# Altium project 724452_RPL-HX_Mobile_AEP_Rev0p91.PrjPcb (part 3 of 13)

### Notes on the sheet
- (in symbol C_RPL_HX_EXT, part A) 1 OF 19

## Sheet 0015_Processor - MEMORY.SchDoc
size A3
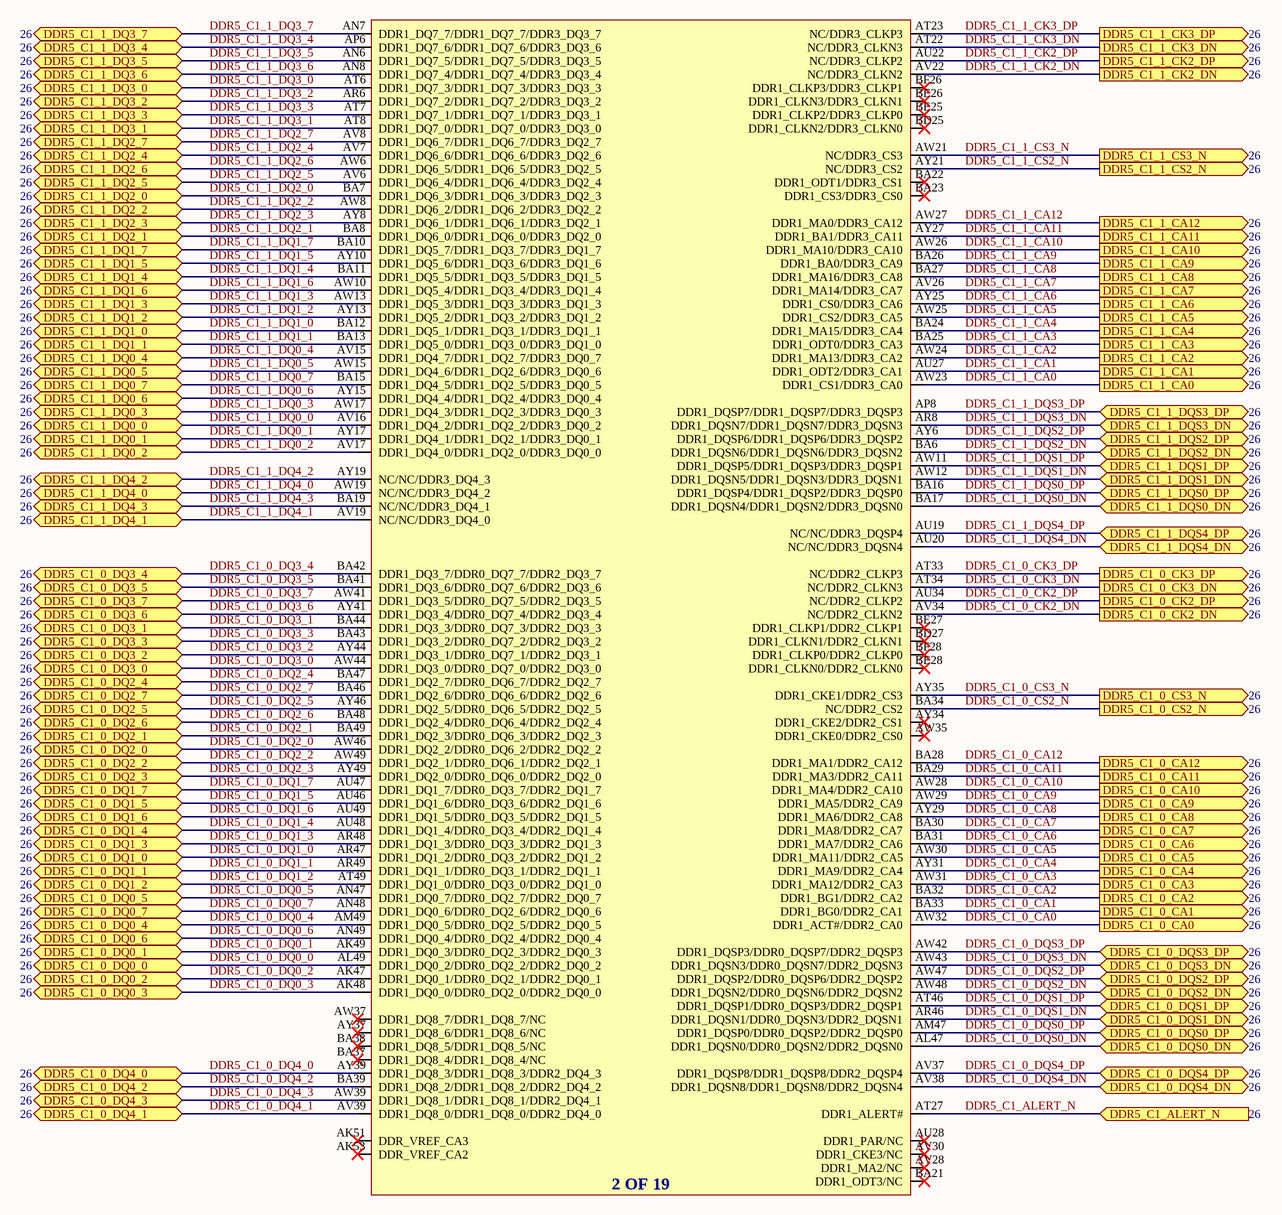
[diagram p39: 0015_Processor - MEMORY.SchDoc]

### Parts
U1401  C_RPL_HX_EXT  (value not drawn)  (part B of 19)

### Ports
DDR5_C1_0_CA0 (out), DDR5_C1_0_CA1 (out), DDR5_C1_0_CA2 (out), DDR5_C1_0_CA3 (out), DDR5_C1_0_CA4 (out), DDR5_C1_0_CA5 (out), DDR5_C1_0_CA6 (out), DDR5_C1_0_CA7 (out), DDR5_C1_0_CA8 (out), DDR5_C1_0_CA9 (out), DDR5_C1_0_CA10 (out), DDR5_C1_0_CA11 (out), DDR5_C1_0_CA12 (out), DDR5_C1_0_CK2_DN (out), DDR5_C1_0_CK2_DP (out), DDR5_C1_0_CK3_DN (out), DDR5_C1_0_CK3_DP (out), DDR5_C1_0_CS2_N (out), DDR5_C1_0_CS3_N (out), DDR5_C1_0_DQ0_0 (bidir), DDR5_C1_0_DQ0_1 (bidir), DDR5_C1_0_DQ0_2 (bidir), DDR5_C1_0_DQ0_3 (bidir), DDR5_C1_0_DQ0_4 (bidir), DDR5_C1_0_DQ0_5 (bidir), DDR5_C1_0_DQ0_6 (bidir), DDR5_C1_0_DQ0_7 (bidir), DDR5_C1_0_DQ1_0 (bidir), DDR5_C1_0_DQ1_1 (bidir), DDR5_C1_0_DQ1_2 (bidir), DDR5_C1_0_DQ1_3 (bidir), DDR5_C1_0_DQ1_4 (bidir), DDR5_C1_0_DQ1_5 (bidir), DDR5_C1_0_DQ1_6 (bidir), DDR5_C1_0_DQ1_7 (bidir), DDR5_C1_0_DQ2_0 (bidir), DDR5_C1_0_DQ2_1 (bidir), DDR5_C1_0_DQ2_2 (bidir), DDR5_C1_0_DQ2_3 (bidir), DDR5_C1_0_DQ2_4 (bidir), DDR5_C1_0_DQ2_5 (bidir), DDR5_C1_0_DQ2_6 (bidir), DDR5_C1_0_DQ2_7 (bidir), DDR5_C1_0_DQ3_0 (bidir), DDR5_C1_0_DQ3_1 (bidir), DDR5_C1_0_DQ3_2 (bidir), DDR5_C1_0_DQ3_3 (bidir), DDR5_C1_0_DQ3_4 (bidir), DDR5_C1_0_DQ3_5 (bidir), DDR5_C1_0_DQ3_6 (bidir), DDR5_C1_0_DQ3_7 (bidir), DDR5_C1_0_DQ4_0 (bidir), DDR5_C1_0_DQ4_1 (bidir), DDR5_C1_0_DQ4_2 (bidir), DDR5_C1_0_DQ4_3 (bidir), DDR5_C1_0_DQS0_DN (bidir), DDR5_C1_0_DQS0_DP (bidir), DDR5_C1_0_DQS1_DN (bidir), DDR5_C1_0_DQS1_DP (bidir), DDR5_C1_0_DQS2_DN (bidir), DDR5_C1_0_DQS2_DP (bidir), DDR5_C1_0_DQS3_DN (bidir), DDR5_C1_0_DQS3_DP (bidir), DDR5_C1_0_DQS4_DN (bidir), DDR5_C1_0_DQS4_DP (bidir), DDR5_C1_1_CA0 (out), DDR5_C1_1_CA1 (out), DDR5_C1_1_CA2 (out), DDR5_C1_1_CA3 (out), DDR5_C1_1_CA4 (out), DDR5_C1_1_CA5 (out), DDR5_C1_1_CA6 (out), DDR5_C1_1_CA7 (out), DDR5_C1_1_CA8 (out), DDR5_C1_1_CA9 (out), DDR5_C1_1_CA10 (out), DDR5_C1_1_CA11 (out), DDR5_C1_1_CA12 (out), DDR5_C1_1_CK2_DN (out), DDR5_C1_1_CK2_DP (out), DDR5_C1_1_CK3_DN (out), DDR5_C1_1_CK3_DP (out), DDR5_C1_1_CS2_N (out), DDR5_C1_1_CS3_N (out), DDR5_C1_1_DQ0_0 (bidir), DDR5_C1_1_DQ0_1 (bidir), DDR5_C1_1_DQ0_2 (bidir), DDR5_C1_1_DQ0_3 (bidir), DDR5_C1_1_DQ0_4 (bidir), DDR5_C1_1_DQ0_5 (bidir), DDR5_C1_1_DQ0_6 (bidir), DDR5_C1_1_DQ0_7 (bidir), DDR5_C1_1_DQ1_0 (bidir), DDR5_C1_1_DQ1_1 (bidir), DDR5_C1_1_DQ1_2 (bidir), DDR5_C1_1_DQ1_3 (bidir), DDR5_C1_1_DQ1_4 (bidir), DDR5_C1_1_DQ1_5 (bidir), DDR5_C1_1_DQ1_6 (bidir), DDR5_C1_1_DQ1_7 (bidir), DDR5_C1_1_DQ2_0 (bidir), DDR5_C1_1_DQ2_1 (bidir), DDR5_C1_1_DQ2_2 (bidir), DDR5_C1_1_DQ2_3 (bidir), DDR5_C1_1_DQ2_4 (bidir), DDR5_C1_1_DQ2_5 (bidir), DDR5_C1_1_DQ2_6 (bidir), DDR5_C1_1_DQ2_7 (bidir), DDR5_C1_1_DQ3_0 (bidir), DDR5_C1_1_DQ3_1 (bidir), DDR5_C1_1_DQ3_2 (bidir), DDR5_C1_1_DQ3_3 (bidir), DDR5_C1_1_DQ3_4 (bidir), DDR5_C1_1_DQ3_5 (bidir), DDR5_C1_1_DQ3_6 (bidir), DDR5_C1_1_DQ3_7 (bidir), DDR5_C1_1_DQ4_0 (bidir), DDR5_C1_1_DQ4_1 (bidir), DDR5_C1_1_DQ4_2 (bidir), DDR5_C1_1_DQ4_3 (bidir), DDR5_C1_1_DQS0_DN (bidir), DDR5_C1_1_DQS0_DP (bidir), DDR5_C1_1_DQS1_DN (bidir), DDR5_C1_1_DQS1_DP (bidir), DDR5_C1_1_DQS2_DN (bidir), DDR5_C1_1_DQS2_DP (bidir), DDR5_C1_1_DQS3_DN (bidir), DDR5_C1_1_DQS3_DP (bidir), DDR5_C1_1_DQS4_DN (bidir), DDR5_C1_1_DQS4_DP (bidir), DDR5_C1_ALERT_N (in)

### Nets
DDR5_C1_0_CA0: U1401.AW32(DDR1_ACT#/DDR2_CA0) ; port DDR5_C1_0_CA0
DDR5_C1_0_CA1: U1401.BA33(DDR1_BG0/DDR2_CA1) ; port DDR5_C1_0_CA1
DDR5_C1_0_CA2: U1401.BA32(DDR1_BG1/DDR2_CA2) ; port DDR5_C1_0_CA2
DDR5_C1_0_CA3: U1401.AW31(DDR1_MA12/DDR2_CA3) ; port DDR5_C1_0_CA3
DDR5_C1_0_CA4: U1401.AY31(DDR1_MA9/DDR2_CA4) ; port DDR5_C1_0_CA4
DDR5_C1_0_CA5: U1401.AW30(DDR1_MA11/DDR2_CA5) ; port DDR5_C1_0_CA5
DDR5_C1_0_CA6: U1401.BA31(DDR1_MA7/DDR2_CA6) ; port DDR5_C1_0_CA6
DDR5_C1_0_CA7: U1401.BA30(DDR1_MA8/DDR2_CA7) ; port DDR5_C1_0_CA7
DDR5_C1_0_CA8: U1401.AY29(DDR1_MA6/DDR2_CA8) ; port DDR5_C1_0_CA8
DDR5_C1_0_CA9: U1401.AW29(DDR1_MA5/DDR2_CA9) ; port DDR5_C1_0_CA9
DDR5_C1_0_CA10: U1401.AW28(DDR1_MA4/DDR2_CA10) ; port DDR5_C1_0_CA10
DDR5_C1_0_CA11: U1401.BA29(DDR1_MA3/DDR2_CA11) ; port DDR5_C1_0_CA11
DDR5_C1_0_CA12: U1401.BA28(DDR1_MA1/DDR2_CA12) ; port DDR5_C1_0_CA12
DDR5_C1_0_CK2_DN: U1401.AV34(NC/DDR2_CLKN2) ; port DDR5_C1_0_CK2_DN
DDR5_C1_0_CK2_DP: U1401.AU34(NC/DDR2_CLKP2) ; port DDR5_C1_0_CK2_DP
DDR5_C1_0_CK3_DN: U1401.AT34(NC/DDR2_CLKN3) ; port DDR5_C1_0_CK3_DN
DDR5_C1_0_CK3_DP: U1401.AT33(NC/DDR2_CLKP3) ; port DDR5_C1_0_CK3_DP
DDR5_C1_0_CS2_N: U1401.BA34(NC/DDR2_CS2) ; port DDR5_C1_0_CS2_N
DDR5_C1_0_CS3_N: U1401.AY35(DDR1_CKE1/DDR2_CS3) ; port DDR5_C1_0_CS3_N
DDR5_C1_0_DQ0_0: U1401.AL49(DDR1_DQ0_2/DDR0_DQ2_2/DDR2_DQ0_2) ; port DDR5_C1_0_DQ0_0
DDR5_C1_0_DQ0_1: U1401.AK49(DDR1_DQ0_3/DDR0_DQ2_3/DDR2_DQ0_3) ; port DDR5_C1_0_DQ0_1
DDR5_C1_0_DQ0_2: U1401.AK47(DDR1_DQ0_1/DDR0_DQ2_1/DDR2_DQ0_1) ; port DDR5_C1_0_DQ0_2
DDR5_C1_0_DQ0_3: U1401.AK48(DDR1_DQ0_0/DDR0_DQ2_0/DDR2_DQ0_0) ; port DDR5_C1_0_DQ0_3
DDR5_C1_0_DQ0_4: U1401.AM49(DDR1_DQ0_5/DDR0_DQ2_5/DDR2_DQ0_5) ; port DDR5_C1_0_DQ0_4
DDR5_C1_0_DQ0_5: U1401.AN47(DDR1_DQ0_7/DDR0_DQ2_7/DDR2_DQ0_7) ; port DDR5_C1_0_DQ0_5
DDR5_C1_0_DQ0_6: U1401.AN49(DDR1_DQ0_4/DDR0_DQ2_4/DDR2_DQ0_4) ; port DDR5_C1_0_DQ0_6
DDR5_C1_0_DQ0_7: U1401.AN48(DDR1_DQ0_6/DDR0_DQ2_6/DDR2_DQ0_6) ; port DDR5_C1_0_DQ0_7
DDR5_C1_0_DQ1_0: U1401.AR47(DDR1_DQ1_2/DDR0_DQ3_2/DDR2_DQ1_2) ; port DDR5_C1_0_DQ1_0
DDR5_C1_0_DQ1_1: U1401.AR49(DDR1_DQ1_1/DDR0_DQ3_1/DDR2_DQ1_1) ; port DDR5_C1_0_DQ1_1
DDR5_C1_0_DQ1_2: U1401.AT49(DDR1_DQ1_0/DDR0_DQ3_0/DDR2_DQ1_0) ; port DDR5_C1_0_DQ1_2
DDR5_C1_0_DQ1_3: U1401.AR48(DDR1_DQ1_3/DDR0_DQ3_3/DDR2_DQ1_3) ; port DDR5_C1_0_DQ1_3
DDR5_C1_0_DQ1_4: U1401.AU48(DDR1_DQ1_4/DDR0_DQ3_4/DDR2_DQ1_4) ; port DDR5_C1_0_DQ1_4
DDR5_C1_0_DQ1_5: U1401.AU46(DDR1_DQ1_6/DDR0_DQ3_6/DDR2_DQ1_6) ; port DDR5_C1_0_DQ1_5
DDR5_C1_0_DQ1_6: U1401.AU49(DDR1_DQ1_5/DDR0_DQ3_5/DDR2_DQ1_5) ; port DDR5_C1_0_DQ1_6
DDR5_C1_0_DQ1_7: U1401.AU47(DDR1_DQ1_7/DDR0_DQ3_7/DDR2_DQ1_7) ; port DDR5_C1_0_DQ1_7
DDR5_C1_0_DQ2_0: U1401.AW46(DDR1_DQ2_2/DDR0_DQ6_2/DDR2_DQ2_2) ; port DDR5_C1_0_DQ2_0
DDR5_C1_0_DQ2_1: U1401.BA49(DDR1_DQ2_3/DDR0_DQ6_3/DDR2_DQ2_3) ; port DDR5_C1_0_DQ2_1
DDR5_C1_0_DQ2_2: U1401.AW49(DDR1_DQ2_1/DDR0_DQ6_1/DDR2_DQ2_1) ; port DDR5_C1_0_DQ2_2
DDR5_C1_0_DQ2_3: U1401.AY49(DDR1_DQ2_0/DDR0_DQ6_0/DDR2_DQ2_0) ; port DDR5_C1_0_DQ2_3
DDR5_C1_0_DQ2_4: U1401.BA47(DDR1_DQ2_7/DDR0_DQ6_7/DDR2_DQ2_7) ; port DDR5_C1_0_DQ2_4
DDR5_C1_0_DQ2_5: U1401.AY46(DDR1_DQ2_5/DDR0_DQ6_5/DDR2_DQ2_5) ; port DDR5_C1_0_DQ2_5
DDR5_C1_0_DQ2_6: U1401.BA48(DDR1_DQ2_4/DDR0_DQ6_4/DDR2_DQ2_4) ; port DDR5_C1_0_DQ2_6
DDR5_C1_0_DQ2_7: U1401.BA46(DDR1_DQ2_6/DDR0_DQ6_6/DDR2_DQ2_6) ; port DDR5_C1_0_DQ2_7
DDR5_C1_0_DQ3_0: U1401.AW44(DDR1_DQ3_0/DDR0_DQ7_0/DDR2_DQ3_0) ; port DDR5_C1_0_DQ3_0
DDR5_C1_0_DQ3_1: U1401.BA44(DDR1_DQ3_3/DDR0_DQ7_3/DDR2_DQ3_3) ; port DDR5_C1_0_DQ3_1
DDR5_C1_0_DQ3_2: U1401.AY44(DDR1_DQ3_1/DDR0_DQ7_1/DDR2_DQ3_1) ; port DDR5_C1_0_DQ3_2
DDR5_C1_0_DQ3_3: U1401.BA43(DDR1_DQ3_2/DDR0_DQ7_2/DDR2_DQ3_2) ; port DDR5_C1_0_DQ3_3
DDR5_C1_0_DQ3_4: U1401.BA42(DDR1_DQ3_7/DDR0_DQ7_7/DDR2_DQ3_7) ; port DDR5_C1_0_DQ3_4
DDR5_C1_0_DQ3_5: U1401.BA41(DDR1_DQ3_6/DDR0_DQ7_6/DDR2_DQ3_6) ; port DDR5_C1_0_DQ3_5
DDR5_C1_0_DQ3_6: U1401.AY41(DDR1_DQ3_4/DDR0_DQ7_4/DDR2_DQ3_4) ; port DDR5_C1_0_DQ3_6
DDR5_C1_0_DQ3_7: U1401.AW41(DDR1_DQ3_5/DDR0_DQ7_5/DDR2_DQ3_5) ; port DDR5_C1_0_DQ3_7
DDR5_C1_0_DQ4_0: U1401.AY39(DDR1_DQ8_3/DDR1_DQ8_3/DDR2_DQ4_3) ; port DDR5_C1_0_DQ4_0
DDR5_C1_0_DQ4_1: U1401.AV39(DDR1_DQ8_0/DDR1_DQ8_0/DDR2_DQ4_0) ; port DDR5_C1_0_DQ4_1
DDR5_C1_0_DQ4_2: U1401.BA39(DDR1_DQ8_2/DDR1_DQ8_2/DDR2_DQ4_2) ; port DDR5_C1_0_DQ4_2
DDR5_C1_0_DQ4_3: U1401.AW39(DDR1_DQ8_1/DDR1_DQ8_1/DDR2_DQ4_1) ; port DDR5_C1_0_DQ4_3
DDR5_C1_0_DQS0_DN: U1401.AL47(DDR1_DQSN0/DDR0_DQSN2/DDR2_DQSN0) ; port DDR5_C1_0_DQS0_DN
DDR5_C1_0_DQS0_DP: U1401.AM47(DDR1_DQSP0/DDR0_DQSP2/DDR2_DQSP0) ; port DDR5_C1_0_DQS0_DP
DDR5_C1_0_DQS1_DN: U1401.AR46(DDR1_DQSN1/DDR0_DQSN3/DDR2_DQSN1) ; port DDR5_C1_0_DQS1_DN
DDR5_C1_0_DQS1_DP: U1401.AT46(DDR1_DQSP1/DDR0_DQSP3/DDR2_DQSP1) ; port DDR5_C1_0_DQS1_DP
DDR5_C1_0_DQS2_DN: U1401.AW48(DDR1_DQSN2/DDR0_DQSN6/DDR2_DQSN2) ; port DDR5_C1_0_DQS2_DN
DDR5_C1_0_DQS2_DP: U1401.AW47(DDR1_DQSP2/DDR0_DQSP6/DDR2_DQSP2) ; port DDR5_C1_0_DQS2_DP
DDR5_C1_0_DQS3_DN: U1401.AW43(DDR1_DQSN3/DDR0_DQSN7/DDR2_DQSN3) ; port DDR5_C1_0_DQS3_DN
DDR5_C1_0_DQS3_DP: U1401.AW42(DDR1_DQSP3/DDR0_DQSP7/DDR2_DQSP3) ; port DDR5_C1_0_DQS3_DP
DDR5_C1_0_DQS4_DN: U1401.AV38(DDR1_DQSN8/DDR1_DQSN8/DDR2_DQSN4) ; port DDR5_C1_0_DQS4_DN
DDR5_C1_0_DQS4_DP: U1401.AV37(DDR1_DQSP8/DDR1_DQSP8/DDR2_DQSP4) ; port DDR5_C1_0_DQS4_DP
DDR5_C1_1_CA0: U1401.AW23(DDR1_CS1/DDR3_CA0) ; port DDR5_C1_1_CA0
DDR5_C1_1_CA1: U1401.AU27(DDR1_ODT2/DDR3_CA1) ; port DDR5_C1_1_CA1
DDR5_C1_1_CA2: U1401.AW24(DDR1_MA13/DDR3_CA2) ; port DDR5_C1_1_CA2
DDR5_C1_1_CA3: U1401.BA25(DDR1_ODT0/DDR3_CA3) ; port DDR5_C1_1_CA3
DDR5_C1_1_CA4: U1401.BA24(DDR1_MA15/DDR3_CA4) ; port DDR5_C1_1_CA4
DDR5_C1_1_CA5: U1401.AW25(DDR1_CS2/DDR3_CA5) ; port DDR5_C1_1_CA5
DDR5_C1_1_CA6: U1401.AY25(DDR1_CS0/DDR3_CA6) ; port DDR5_C1_1_CA6
DDR5_C1_1_CA7: U1401.AV26(DDR1_MA14/DDR3_CA7) ; port DDR5_C1_1_CA7
DDR5_C1_1_CA8: U1401.BA27(DDR1_MA16/DDR3_CA8) ; port DDR5_C1_1_CA8
DDR5_C1_1_CA9: U1401.BA26(DDR1_BA0/DDR3_CA9) ; port DDR5_C1_1_CA9
DDR5_C1_1_CA10: U1401.AW26(DDR1_MA10/DDR3_CA10) ; port DDR5_C1_1_CA10
DDR5_C1_1_CA11: U1401.AY27(DDR1_BA1/DDR3_CA11) ; port DDR5_C1_1_CA11
DDR5_C1_1_CA12: U1401.AW27(DDR1_MA0/DDR3_CA12) ; port DDR5_C1_1_CA12
DDR5_C1_1_CK2_DN: U1401.AV22(NC/DDR3_CLKN2) ; port DDR5_C1_1_CK2_DN
DDR5_C1_1_CK2_DP: U1401.AU22(NC/DDR3_CLKP2) ; port DDR5_C1_1_CK2_DP
DDR5_C1_1_CK3_DN: U1401.AT22(NC/DDR3_CLKN3) ; port DDR5_C1_1_CK3_DN
DDR5_C1_1_CK3_DP: U1401.AT23(NC/DDR3_CLKP3) ; port DDR5_C1_1_CK3_DP
DDR5_C1_1_CS2_N: U1401.AY21(NC/DDR3_CS2) ; port DDR5_C1_1_CS2_N
DDR5_C1_1_CS3_N: U1401.AW21(NC/DDR3_CS3) ; port DDR5_C1_1_CS3_N
DDR5_C1_1_DQ0_0: U1401.AV16(DDR1_DQ4_2/DDR1_DQ2_2/DDR3_DQ0_2) ; port DDR5_C1_1_DQ0_0
DDR5_C1_1_DQ0_1: U1401.AY17(DDR1_DQ4_1/DDR1_DQ2_1/DDR3_DQ0_1) ; port DDR5_C1_1_DQ0_1
DDR5_C1_1_DQ0_2: U1401.AV17(DDR1_DQ4_0/DDR1_DQ2_0/DDR3_DQ0_0) ; port DDR5_C1_1_DQ0_2
DDR5_C1_1_DQ0_3: U1401.AW17(DDR1_DQ4_3/DDR1_DQ2_3/DDR3_DQ0_3) ; port DDR5_C1_1_DQ0_3
DDR5_C1_1_DQ0_4: U1401.AV15(DDR1_DQ4_7/DDR1_DQ2_7/DDR3_DQ0_7) ; port DDR5_C1_1_DQ0_4
DDR5_C1_1_DQ0_5: U1401.AW15(DDR1_DQ4_6/DDR1_DQ2_6/DDR3_DQ0_6) ; port DDR5_C1_1_DQ0_5
DDR5_C1_1_DQ0_6: U1401.AY15(DDR1_DQ4_4/DDR1_DQ2_4/DDR3_DQ0_4) ; port DDR5_C1_1_DQ0_6
DDR5_C1_1_DQ0_7: U1401.BA15(DDR1_DQ4_5/DDR1_DQ2_5/DDR3_DQ0_5) ; port DDR5_C1_1_DQ0_7
DDR5_C1_1_DQ1_0: U1401.BA12(DDR1_DQ5_1/DDR1_DQ3_1/DDR3_DQ1_1) ; port DDR5_C1_1_DQ1_0
DDR5_C1_1_DQ1_1: U1401.BA13(DDR1_DQ5_0/DDR1_DQ3_0/DDR3_DQ1_0) ; port DDR5_C1_1_DQ1_1
DDR5_C1_1_DQ1_2: U1401.AY13(DDR1_DQ5_2/DDR1_DQ3_2/DDR3_DQ1_2) ; port DDR5_C1_1_DQ1_2
DDR5_C1_1_DQ1_3: U1401.AW13(DDR1_DQ5_3/DDR1_DQ3_3/DDR3_DQ1_3) ; port DDR5_C1_1_DQ1_3
DDR5_C1_1_DQ1_4: U1401.BA11(DDR1_DQ5_5/DDR1_DQ3_5/DDR3_DQ1_5) ; port DDR5_C1_1_DQ1_4
DDR5_C1_1_DQ1_5: U1401.AY10(DDR1_DQ5_6/DDR1_DQ3_6/DDR3_DQ1_6) ; port DDR5_C1_1_DQ1_5
DDR5_C1_1_DQ1_6: U1401.AW10(DDR1_DQ5_4/DDR1_DQ3_4/DDR3_DQ1_4) ; port DDR5_C1_1_DQ1_6
DDR5_C1_1_DQ1_7: U1401.BA10(DDR1_DQ5_7/DDR1_DQ3_7/DDR3_DQ1_7) ; port DDR5_C1_1_DQ1_7
DDR5_C1_1_DQ2_0: U1401.BA7(DDR1_DQ6_3/DDR1_DQ6_3/DDR3_DQ2_3) ; port DDR5_C1_1_DQ2_0
DDR5_C1_1_DQ2_1: U1401.BA8(DDR1_DQ6_0/DDR1_DQ6_0/DDR3_DQ2_0) ; port DDR5_C1_1_DQ2_1
DDR5_C1_1_DQ2_2: U1401.AW8(DDR1_DQ6_2/DDR1_DQ6_2/DDR3_DQ2_2) ; port DDR5_C1_1_DQ2_2
DDR5_C1_1_DQ2_3: U1401.AY8(DDR1_DQ6_1/DDR1_DQ6_1/DDR3_DQ2_1) ; port DDR5_C1_1_DQ2_3
DDR5_C1_1_DQ2_4: U1401.AV7(DDR1_DQ6_6/DDR1_DQ6_6/DDR3_DQ2_6) ; port DDR5_C1_1_DQ2_4
DDR5_C1_1_DQ2_5: U1401.AV6(DDR1_DQ6_4/DDR1_DQ6_4/DDR3_DQ2_4) ; port DDR5_C1_1_DQ2_5
DDR5_C1_1_DQ2_6: U1401.AW6(DDR1_DQ6_5/DDR1_DQ6_5/DDR3_DQ2_5) ; port DDR5_C1_1_DQ2_6
DDR5_C1_1_DQ2_7: U1401.AV8(DDR1_DQ6_7/DDR1_DQ6_7/DDR3_DQ2_7) ; port DDR5_C1_1_DQ2_7
DDR5_C1_1_DQ3_0: U1401.AT6(DDR1_DQ7_3/DDR1_DQ7_3/DDR3_DQ3_3) ; port DDR5_C1_1_DQ3_0
DDR5_C1_1_DQ3_1: U1401.AT8(DDR1_DQ7_0/DDR1_DQ7_0/DDR3_DQ3_0) ; port DDR5_C1_1_DQ3_1
DDR5_C1_1_DQ3_2: U1401.AR6(DDR1_DQ7_2/DDR1_DQ7_2/DDR3_DQ3_2) ; port DDR5_C1_1_DQ3_2
DDR5_C1_1_DQ3_3: U1401.AT7(DDR1_DQ7_1/DDR1_DQ7_1/DDR3_DQ3_1) ; port DDR5_C1_1_DQ3_3
DDR5_C1_1_DQ3_4: U1401.AP6(DDR1_DQ7_6/DDR1_DQ7_6/DDR3_DQ3_6) ; port DDR5_C1_1_DQ3_4
DDR5_C1_1_DQ3_5: U1401.AN6(DDR1_DQ7_5/DDR1_DQ7_5/DDR3_DQ3_5) ; port DDR5_C1_1_DQ3_5
DDR5_C1_1_DQ3_6: U1401.AN8(DDR1_DQ7_4/DDR1_DQ7_4/DDR3_DQ3_4) ; port DDR5_C1_1_DQ3_6
DDR5_C1_1_DQ3_7: U1401.AN7(DDR1_DQ7_7/DDR1_DQ7_7/DDR3_DQ3_7) ; port DDR5_C1_1_DQ3_7
DDR5_C1_1_DQ4_0: U1401.AW19(NC/NC/DDR3_DQ4_2) ; port DDR5_C1_1_DQ4_0
DDR5_C1_1_DQ4_1: U1401.AV19(NC/NC/DDR3_DQ4_0) ; port DDR5_C1_1_DQ4_1
DDR5_C1_1_DQ4_2: U1401.AY19(NC/NC/DDR3_DQ4_3) ; port DDR5_C1_1_DQ4_2
DDR5_C1_1_DQ4_3: U1401.BA19(NC/NC/DDR3_DQ4_1) ; port DDR5_C1_1_DQ4_3
DDR5_C1_1_DQS0_DN: U1401.BA17(DDR1_DQSN4/DDR1_DQSN2/DDR3_DQSN0) ; port DDR5_C1_1_DQS0_DN
DDR5_C1_1_DQS0_DP: U1401.BA16(DDR1_DQSP4/DDR1_DQSP2/DDR3_DQSP0) ; port DDR5_C1_1_DQS0_DP
DDR5_C1_1_DQS1_DN: U1401.AW12(DDR1_DQSN5/DDR1_DQSN3/DDR3_DQSN1) ; port DDR5_C1_1_DQS1_DN
DDR5_C1_1_DQS1_DP: U1401.AW11(DDR1_DQSP5/DDR1_DQSP3/DDR3_DQSP1) ; port DDR5_C1_1_DQS1_DP
DDR5_C1_1_DQS2_DN: U1401.BA6(DDR1_DQSN6/DDR1_DQSN6/DDR3_DQSN2) ; port DDR5_C1_1_DQS2_DN
DDR5_C1_1_DQS2_DP: U1401.AY6(DDR1_DQSP6/DDR1_DQSP6/DDR3_DQSP2) ; port DDR5_C1_1_DQS2_DP
DDR5_C1_1_DQS3_DN: U1401.AR8(DDR1_DQSN7/DDR1_DQSN7/DDR3_DQSN3) ; port DDR5_C1_1_DQS3_DN
DDR5_C1_1_DQS3_DP: U1401.AP8(DDR1_DQSP7/DDR1_DQSP7/DDR3_DQSP3) ; port DDR5_C1_1_DQS3_DP
DDR5_C1_1_DQS4_DN: U1401.AU20(NC/NC/DDR3_DQSN4) ; port DDR5_C1_1_DQS4_DN
DDR5_C1_1_DQS4_DP: U1401.AU19(NC/NC/DDR3_DQSP4) ; port DDR5_C1_1_DQS4_DP
DDR5_C1_ALERT_N: U1401.AT27(DDR1_ALERT#) ; port DDR5_C1_ALERT_N

Not connected (* = marked no-connect by the designer): U1401 AK51(DDR_VREF_CA3)* AK53(DDR_VREF_CA2)* AU28(DDR1_PAR/NC)* AV28(DDR1_MA2/NC)* AV30(DDR1_CKE3/NC)* AW35(DDR1_CKE0/DDR2_CS0)* AW37(DDR1_DQ8_7/DDR1_DQ8_7/NC)* AY34(DDR1_CKE2/DDR2_CS1)* AY37(DDR1_DQ8_6/DDR1_DQ8_6/NC)* BA21(DDR1_ODT3/NC)* BA22(DDR1_ODT1/DDR3_CS1)* BA23(DDR1_CS3/DDR3_CS0)* BA37(DDR1_DQ8_4/DDR1_DQ8_4/NC)* BA38(DDR1_DQ8_5/DDR1_DQ8_5/NC)* BD25(DDR1_CLKN2/DDR3_CLKN0)* BD27(DDR1_CLKN1/DDR2_CLKN1)* BE25(DDR1_CLKP2/DDR3_CLKP0)* BE26(DDR1_CLKN3/DDR3_CLKN1)* BE27(DDR1_CLKP1/DDR2_CLKP1)* BE28(DDR1_CLKN0/DDR2_CLKN0)* BF26(DDR1_CLKP3/DDR3_CLKP1)* BF28(DDR1_CLKP0/DDR2_CLKP0)*

### Notes on the sheet
- (in symbol C_RPL_HX_EXT, part B) 2 OF 19

## Sheet 0016_Processor - PM , C.SchDoc
size 848 x 558 mm
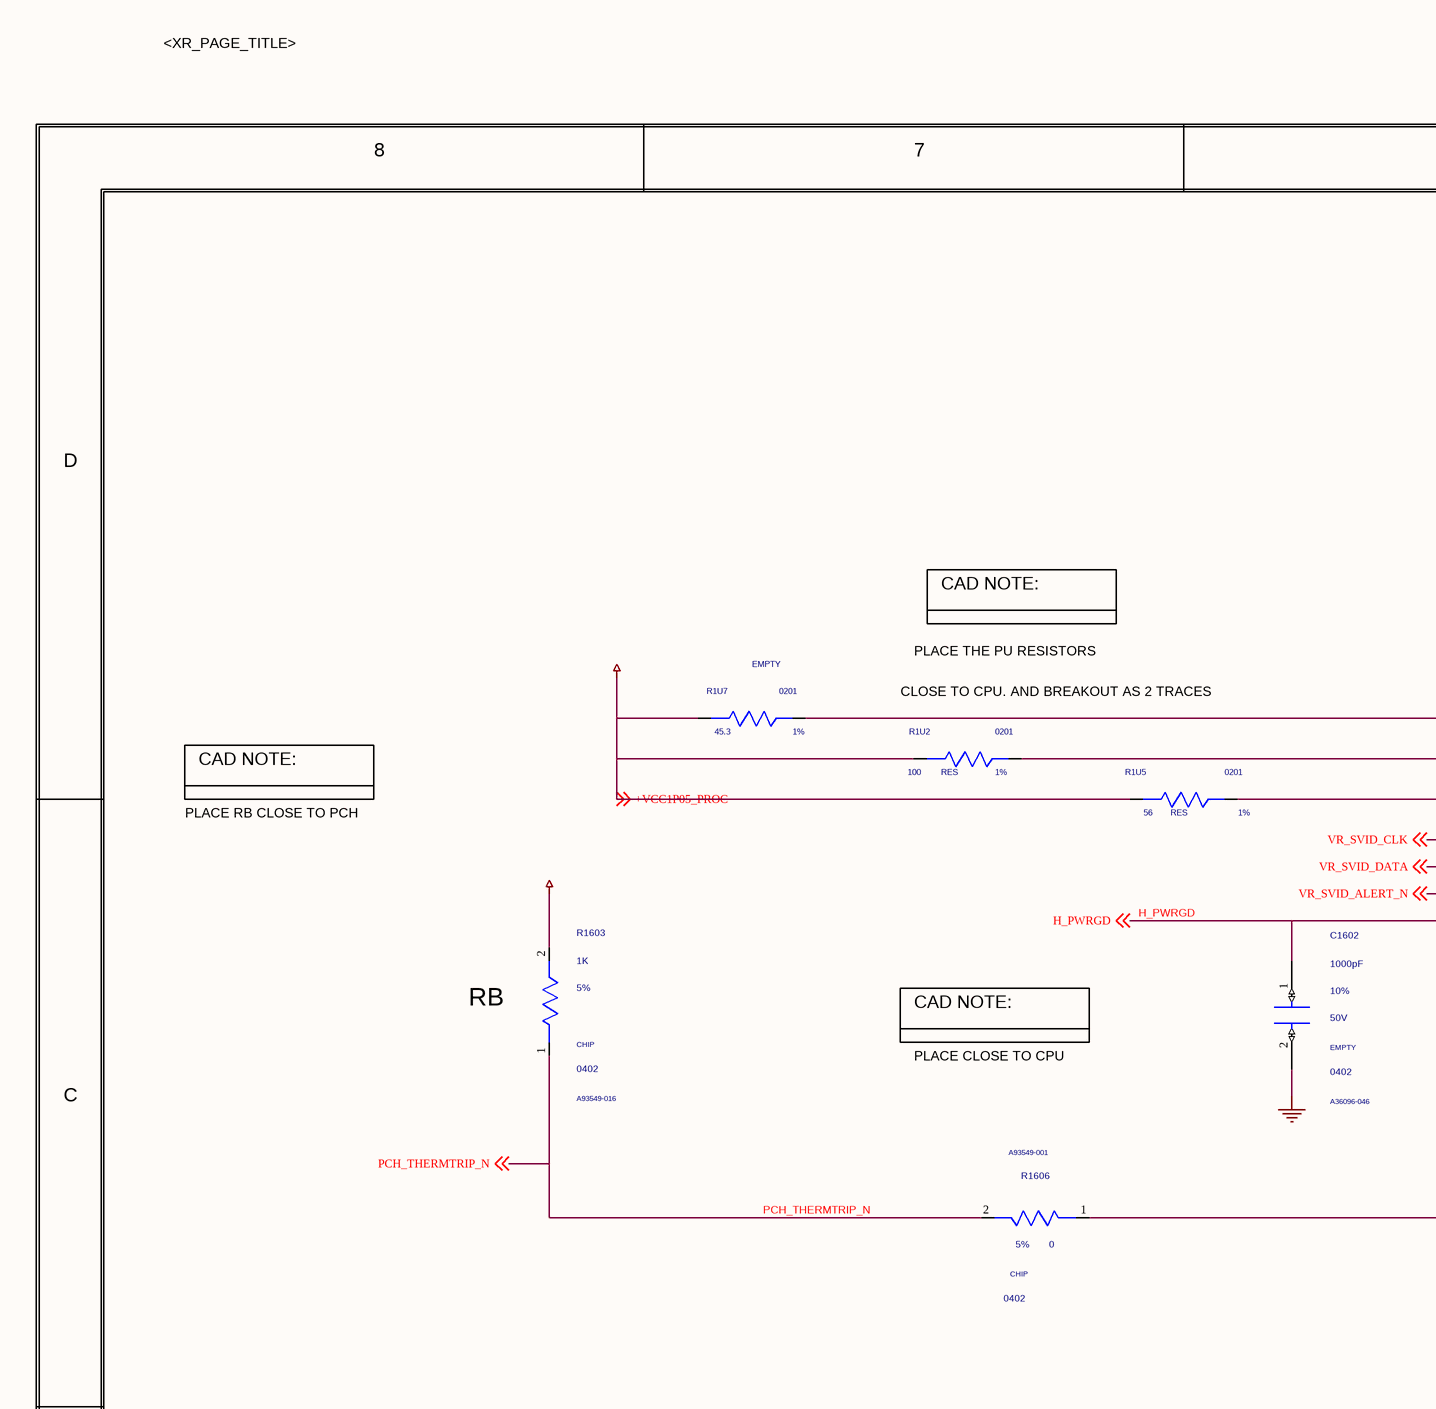
[diagram p40: 0016_Processor - PM , C.SchDoc, top left]
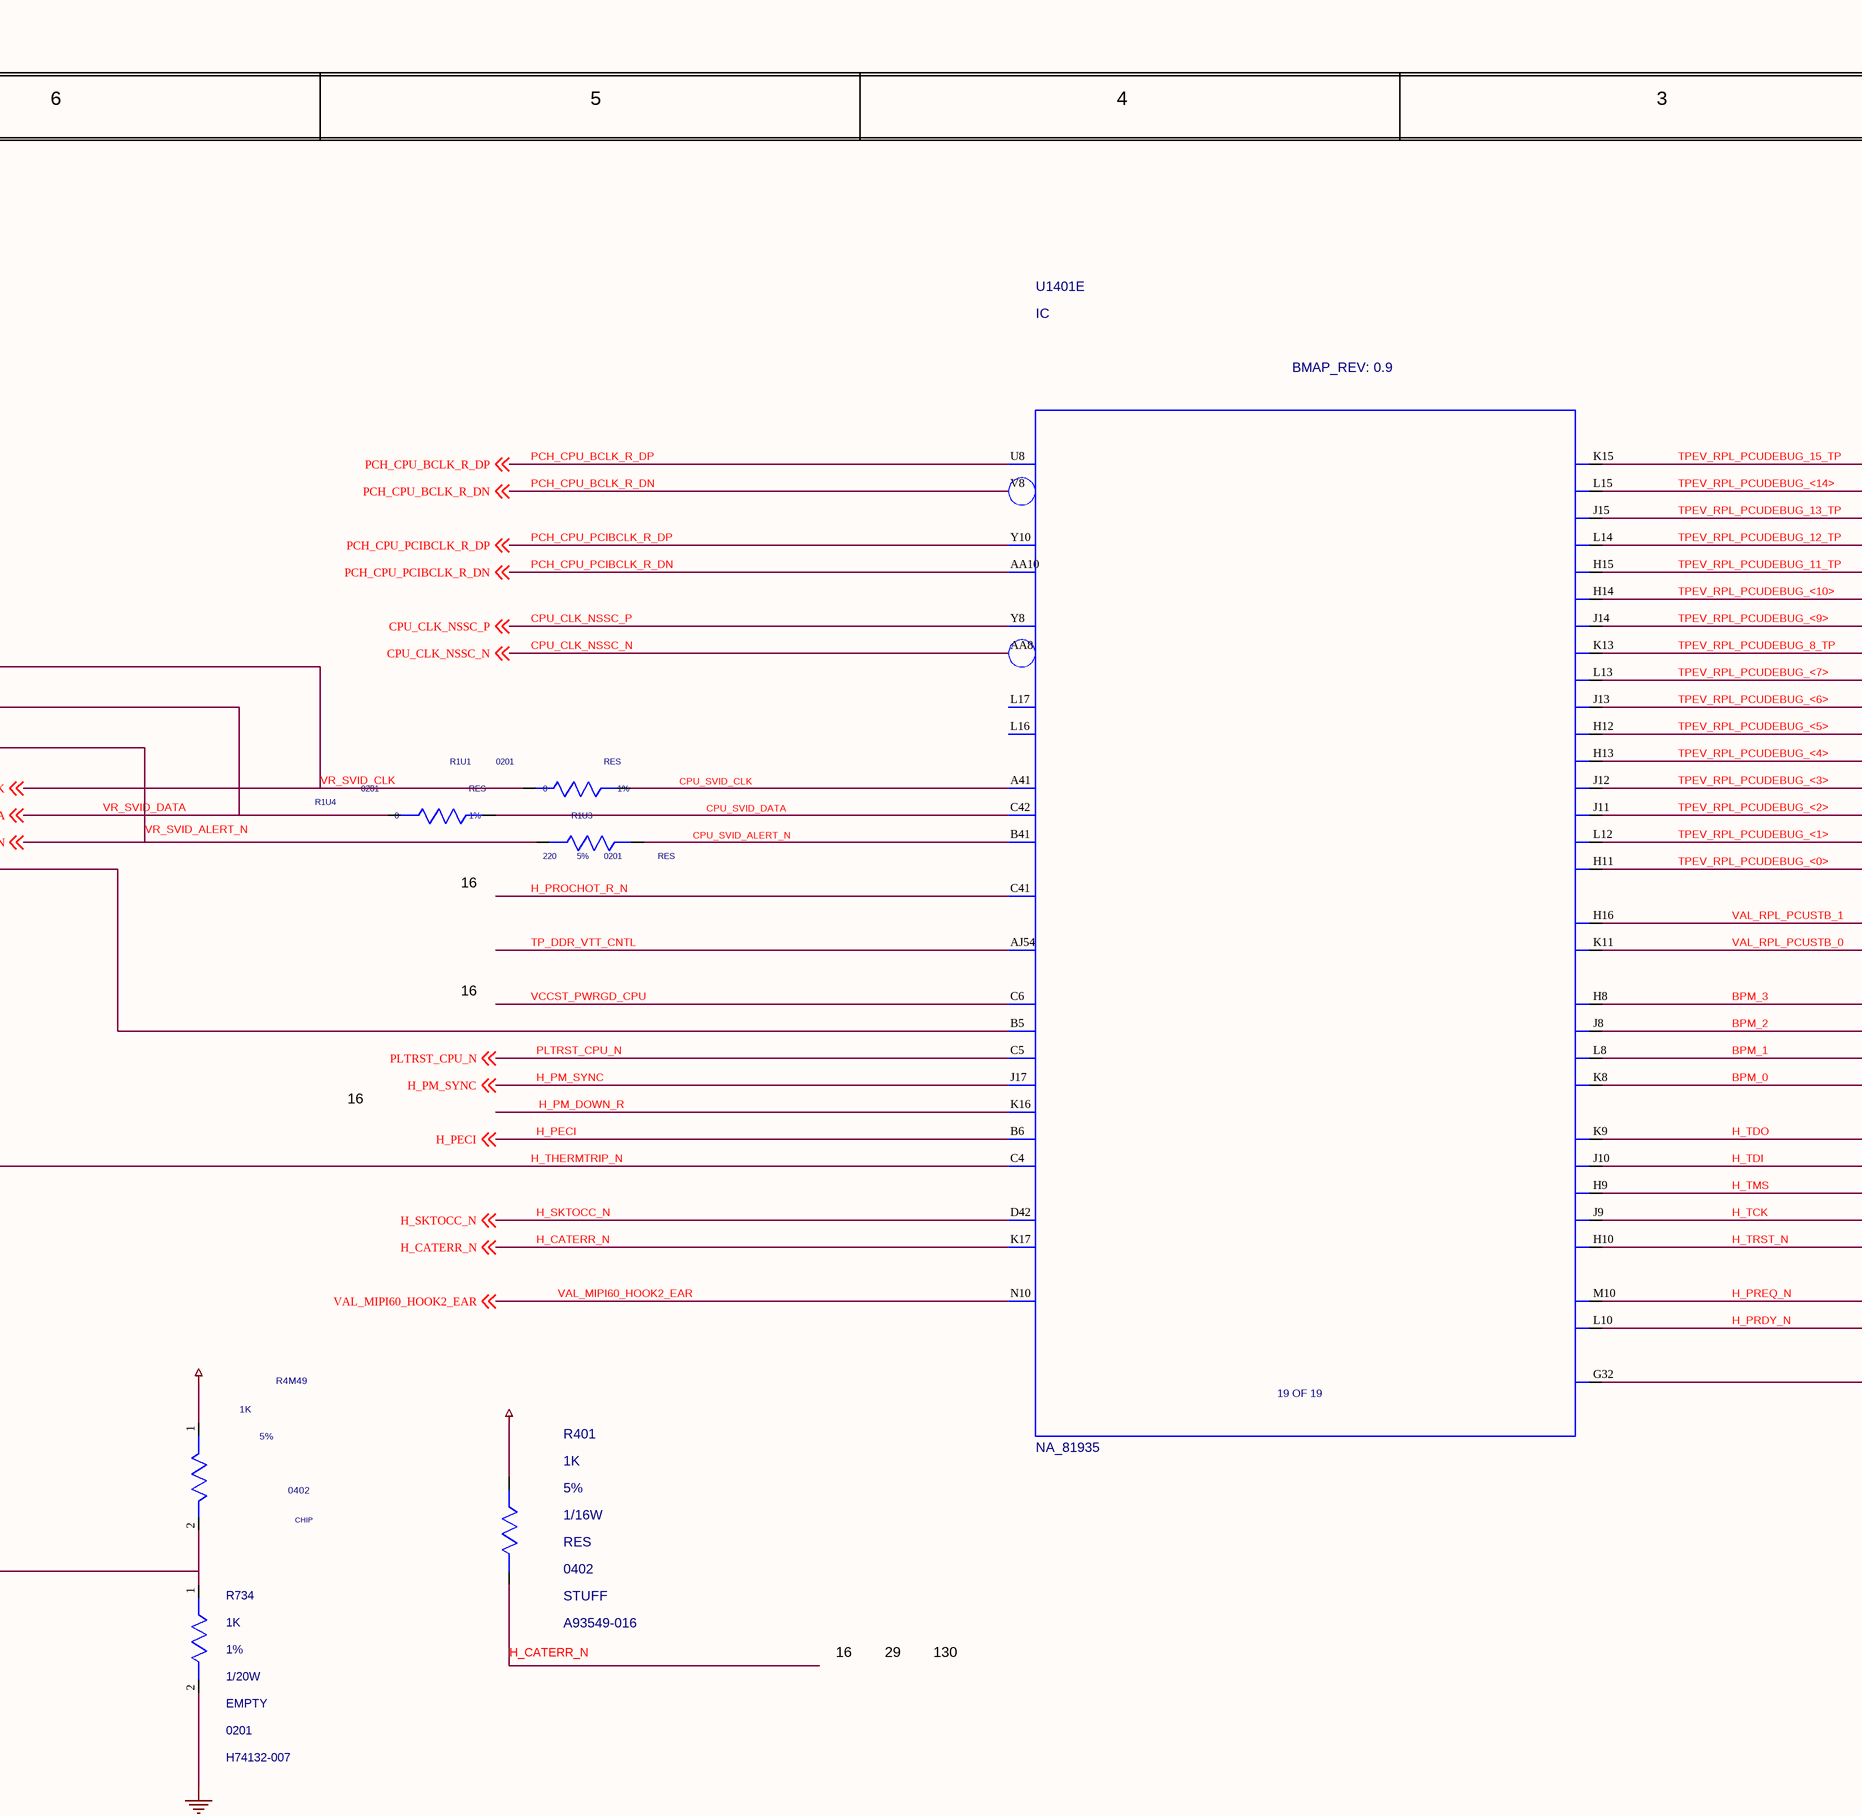
[diagram p41: 0016_Processor - PM , C.SchDoc, top middle]
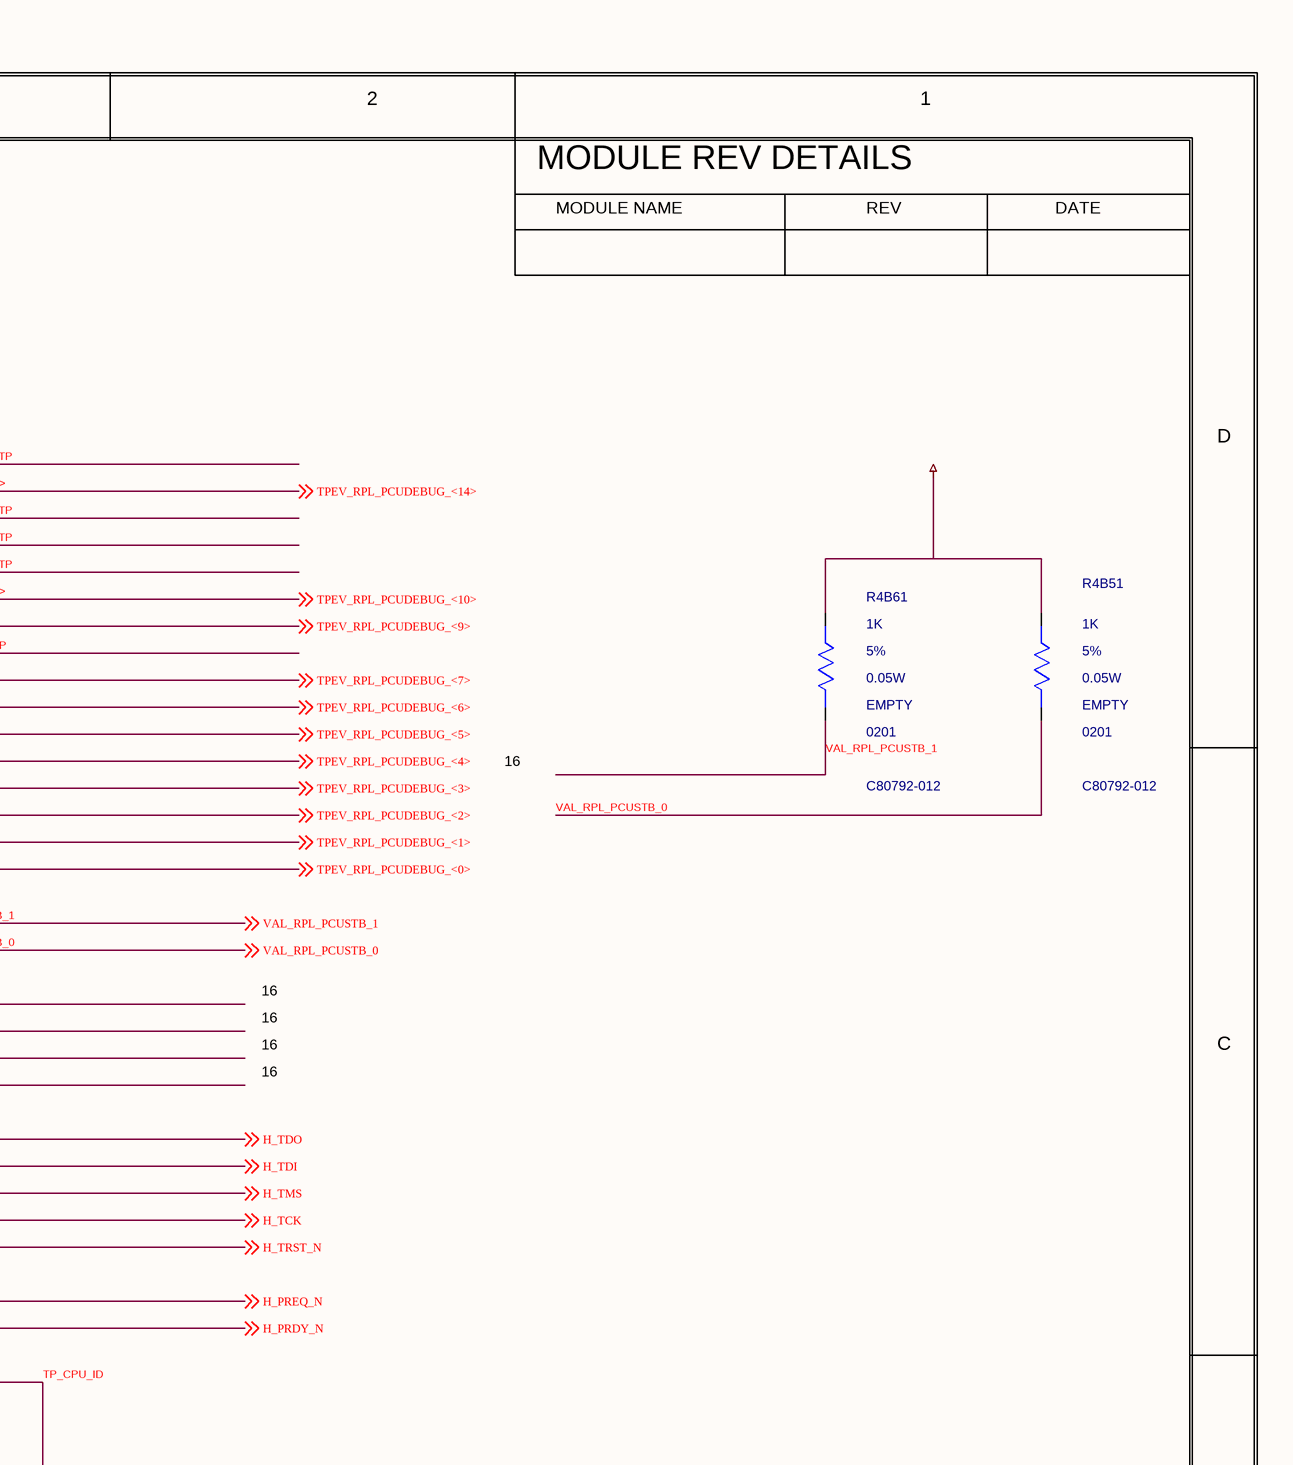
[diagram p42: 0016_Processor - PM , C.SchDoc, top right]
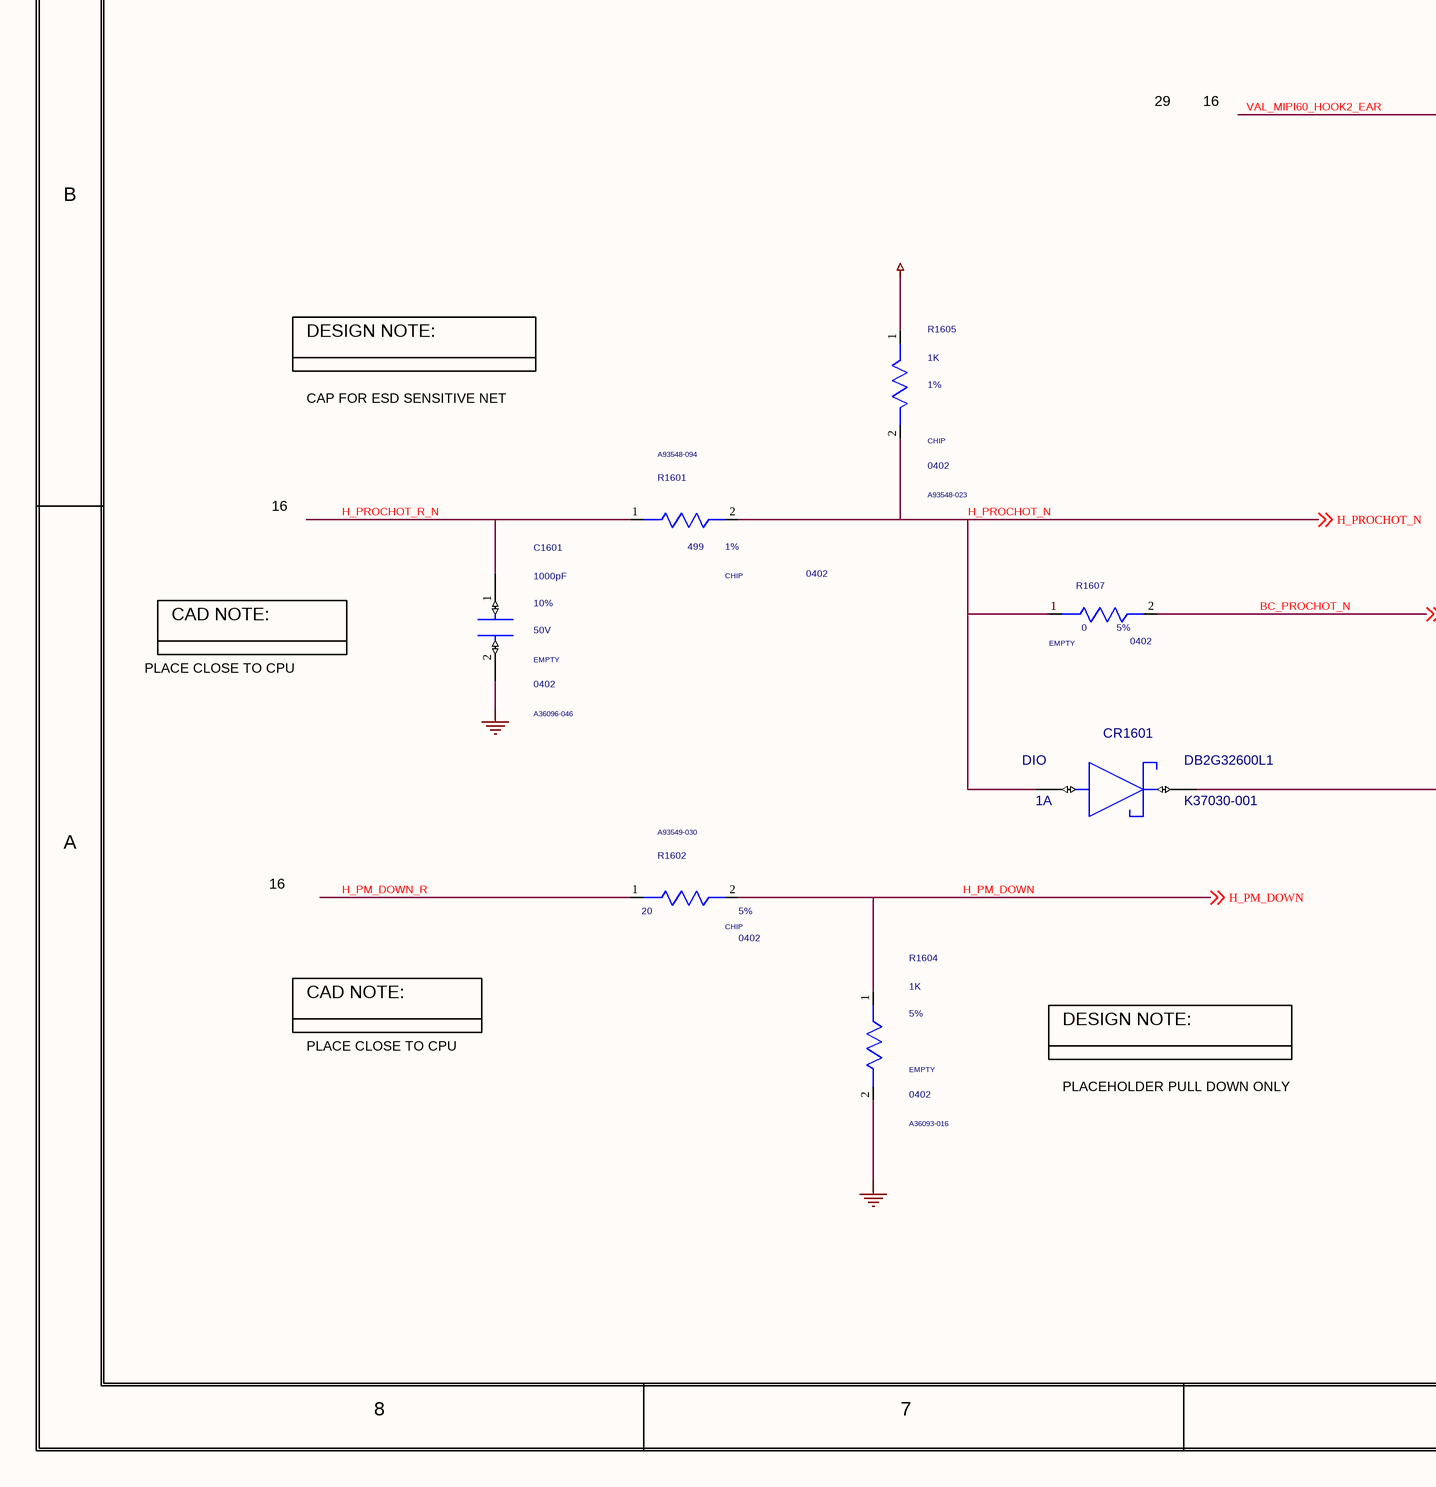
[diagram p43: 0016_Processor - PM , C.SchDoc, bottom left]
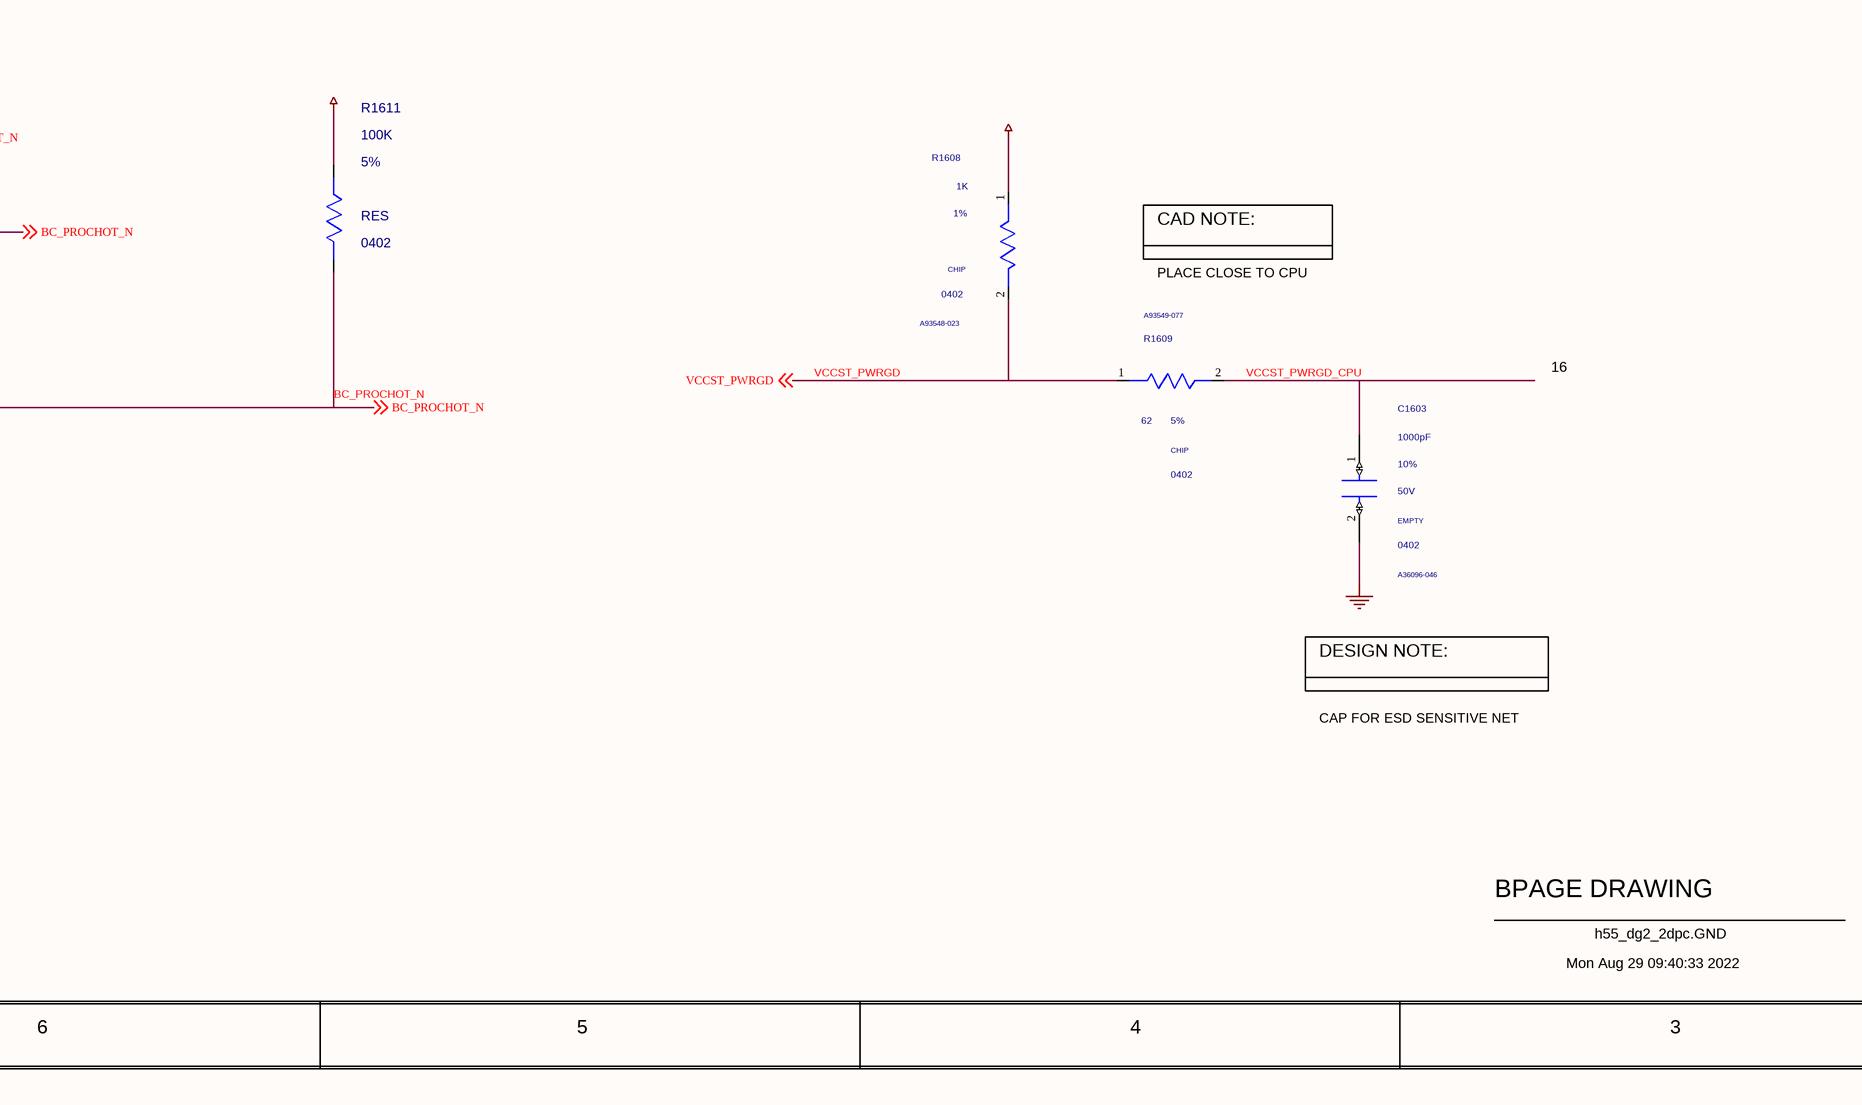
[diagram p44: 0016_Processor - PM , C.SchDoc, bottom middle]
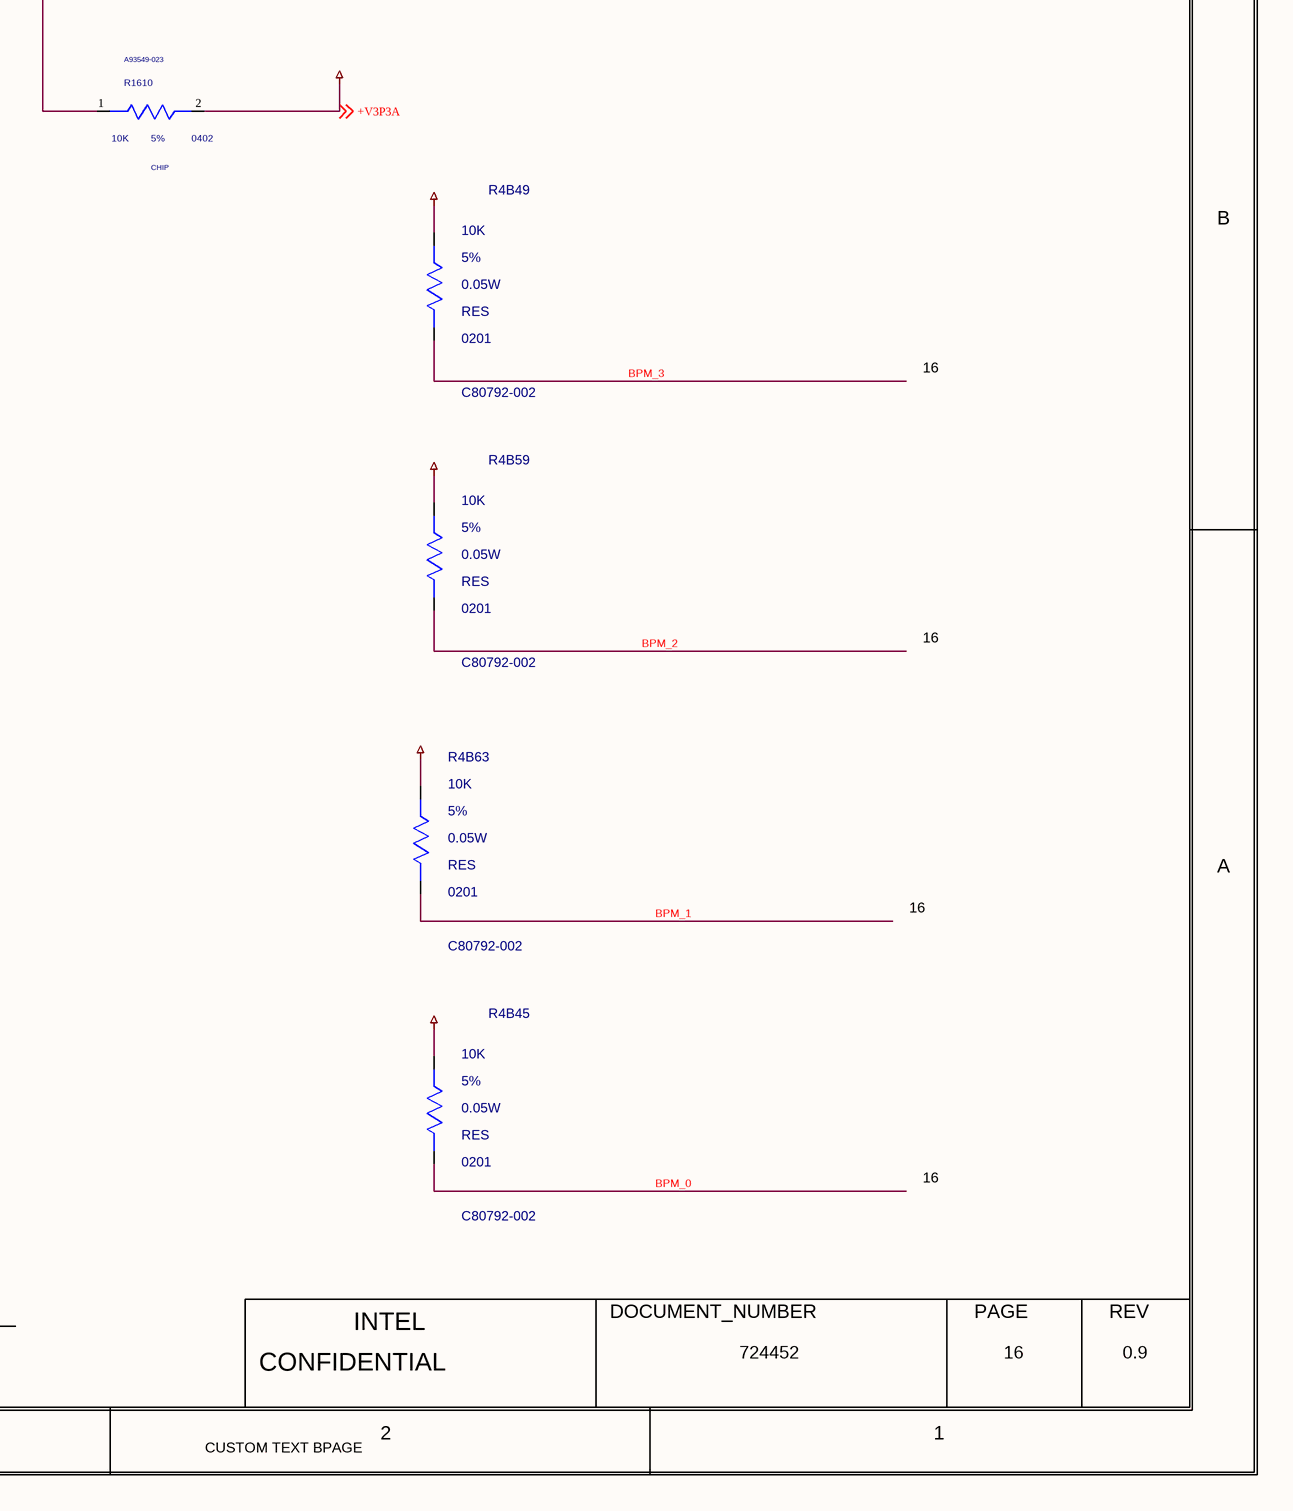
[diagram p45: 0016_Processor - PM , C.SchDoc, bottom right]

### Parts
C1601  1000pF  MATERIAL: EMPTY  PACK_TYPE: 0402  PART_NUMBER: A36096-046  TOLERANCE: 10%  VOLTAGE: 50V  [SMC0402IA]
C1602  1000pF  MATERIAL: EMPTY  PACK_TYPE: 0402  PART_NUMBER: A36096-046  TOLERANCE: 10%  VOLTAGE: 50V  [SMC0402IA]
C1603  1000pF  MATERIAL: EMPTY  PACK_TYPE: 0402  PART_NUMBER: A36096-046  TOLERANCE: 10%  VOLTAGE: 50V  [SMC0402IA]
CR1601  DB2G32600L1  CURRENT: 1A  MATERIAL: DIO  PART_NUMBER: K37030-001  [TK0_SCR0402_1050X650_MA]
R1U1  0  MATERIAL: RES  PACK_TYPE: 0201  TOLERANCE: 1%  [CTK2_SM0201_630X330_MA]
R1U2  100  MATERIAL: RES  PACK_TYPE: 0201  TOLERANCE: 1%  [CTK2_SM0201_630X330_MA]
R1U3  220  MATERIAL: RES  PACK_TYPE: 0201  TOLERANCE: 5%  [CTK2_SM0201_630X330_MA]
R1U4  0  MATERIAL: RES  PACK_TYPE: 0201  TOLERANCE: 1%  [CTK2_SM0201_630X330_MA]
R1U5  56  MATERIAL: RES  PACK_TYPE: 0201  TOLERANCE: 1%  [CTK2_SM0201_650X350_MA]
R1U7  45.3  MATERIAL: EMPTY  PACK_TYPE: 0201  TOLERANCE: 1%  [CTK2_SM0201_650X350_MA]
R4B45  10K  MATERIAL: RES  PACK_TYPE: 0201  PART_NUMBER: C80792-002  TOLERANCE: 5%  WATTAGE: 0.05W  [CTK2_SM0201_630X330_MA]
R4B49  10K  MATERIAL: RES  PACK_TYPE: 0201  PART_NUMBER: C80792-002  TOLERANCE: 5%  WATTAGE: 0.05W  [CTK2_SM0201_630X330_MA]
R4B51  1K  MATERIAL: EMPTY  PACK_TYPE: 0201  PART_NUMBER: C80792-012  TOLERANCE: 5%  WATTAGE: 0.05W  [CTK2_SM0201_630X330_MA]
R4B59  10K  MATERIAL: RES  PACK_TYPE: 0201  PART_NUMBER: C80792-002  TOLERANCE: 5%  WATTAGE: 0.05W  [CTK2_SM0201_630X330_MA]
R4B61  1K  MATERIAL: EMPTY  PACK_TYPE: 0201  PART_NUMBER: C80792-012  TOLERANCE: 5%  WATTAGE: 0.05W  [CTK2_SM0201_630X330_MA]
R4B63  10K  MATERIAL: RES  PACK_TYPE: 0201  PART_NUMBER: C80792-002  TOLERANCE: 5%  WATTAGE: 0.05W  [CTK2_SM0201_630X330_MA]
R4M49  1K  MATERIAL: CHIP  PACK_TYPE: 0402  TOLERANCE: 5%  [SMR0402IA]
R401  1K  BOM_USE: STUFF  MATERIAL: RES  PACK_TYPE: 0402  PART_NUMBER: A93549-016  TOLERANCE: 5%  WATTAGE: 1/16W  [TK0_SM0402_1100X550_MC]
R734  1K  MATERIAL: EMPTY  PACK_TYPE: 0201  PART_NUMBER: H74132-007  TOLERANCE: 1%  WATTAGE: 1/20W  [SMR0201IA]
R1601  499  MATERIAL: CHIP  PACK_TYPE: 0402  PART_NUMBER: A93548-094  TOLERANCE: 1%  [SMR0402IA]
R1602  20  MATERIAL: CHIP  PACK_TYPE: 0402  PART_NUMBER: A93549-030  TOLERANCE: 5%  [SMR0402IA]
R1603  1K  MATERIAL: CHIP  PACK_TYPE: 0402  PART_NUMBER: A93549-016  TOLERANCE: 5%  [SMR0402IA]
R1604  1K  MATERIAL: EMPTY  PACK_TYPE: 0402  PART_NUMBER: A36093-016  TOLERANCE: 5%  [SMR0402IA]
R1605  1K  MATERIAL: CHIP  PACK_TYPE: 0402  PART_NUMBER: A93548-023  TOLERANCE: 1%  [SMR0402IA]
R1606  0  MATERIAL: CHIP  PACK_TYPE: 0402  PART_NUMBER: A93549-001  TOLERANCE: 5%  [SMR0402IA]
R1607  0  MATERIAL: EMPTY  PACK_TYPE: 0402  TOLERANCE: 5%  [SMR0402IA]
R1608  1K  MATERIAL: CHIP  PACK_TYPE: 0402  PART_NUMBER: A93548-023  TOLERANCE: 1%  [SMR0402IA]
R1609  62  MATERIAL: CHIP  PACK_TYPE: 0402  PART_NUMBER: A93549-077  TOLERANCE: 5%  [SMR0402IA]
R1610  10K  MATERIAL: CHIP  PACK_TYPE: 0402  PART_NUMBER: A93549-023  TOLERANCE: 5%  [SMR0402IA]
R1611  100K  MATERIAL: RES  PACK_TYPE: 0402  TOLERANCE: 5%  [CTK2_SM0402_1100X550_MA]
U1401  BMAP_REV: 0.9  MATERIAL: IC  PART_NUMBER: NA_81935  PART_SYM_NUM: 19 OF 19  [CLPDB_BGA1964_RPL_HX_LP7530_MA]  (hidden comment: C_RPL_HX_EXT)  (part E of 19)

### Nets
+V3P3A: R1610.2(B) R1611.1(A) ; off-sheet +V3P3A
+VCC1P05_PROC: R1U2.1(A) R1U5.1(A) R1U7.1(A) R4M49.1(A) R401.1(A) R1603.2(B) R1605.1(A) R1608.1(A) ; off-sheet +VCC1P05_PROC
+VCC_CFG_PU_OUT: R4B45.1(A) R4B49.1(A) R4B51.1(A) R4B59.1(A) R4B61.1(A) R4B63.1(A)
GND: C1601.2(B) C1602.2(B) C1603.2(B) R734.2(B) R1604.2(B)  [project net EXP_A_RX_4_DP]
BC_PROCHOT_N: CR1601.1(CATHODE) R1607.2(B) R1611.2(B) ; off-sheet BC_PROCHOT_N
BPM_0: R4B45.2(B) U1401.K8(BPM#_0)
BPM_1: R4B63.2(B) U1401.L8(BPM#_1)
BPM_2: R4B59.2(B) U1401.J8(BPM#_2)
BPM_3: R4B49.2(B) U1401.H8(BPM#_3)
CPU_CLK_NSSC_N: U1401.AA8(CLK_NSSC_N) ; off-sheet CPU_CLK_NSSC_N
CPU_CLK_NSSC_P: U1401.Y8(CLK_NSSC_P) ; off-sheet CPU_CLK_NSSC_P
CPU_SVID_ALERT_N: R1U3.2(B) U1401.B41(VIDALERT#)
CPU_SVID_CLK: R1U1.2(B) U1401.A41(VIDSCK)
CPU_SVID_DATA: R1U4.2(B) U1401.C42(VIDSOUT)
H_CATERR_N: R401.2(B) U1401.K17(CATERR#) ; off-sheet H_CATERR_N
H_PECI: U1401.B6(PECI) ; off-sheet H_PECI
H_PM_DOWN: R1602.2(B) R1604.1(A) ; off-sheet H_PM_DOWN
H_PM_DOWN_R: R1602.1(A) U1401.K16(PM_DOWN)
H_PM_SYNC: U1401.J17(PM_SYNC) ; off-sheet H_PM_SYNC
H_PRDY_N: U1401.L10(PROC_PRDY#) ; off-sheet H_PRDY_N
H_PREQ_N: U1401.M10(PROC_PREQ#) ; off-sheet H_PREQ_N
H_PROCHOT_N: CR1601.2(ANODE) R1601.2(B) R1605.2(B) R1607.1(A) ; off-sheet H_PROCHOT_N
H_PROCHOT_R_N: C1601.1(A) R1601.1(A) U1401.C41(PROCHOT#)
H_PWRGD: C1602.1(A) U1401.B5(PROCPWRGD) ; off-sheet H_PWRGD
H_SKTOCC_N: U1401.D42(SKTOCC#) ; off-sheet H_SKTOCC_N
H_TCK: U1401.J9(PROC_TCK) ; off-sheet H_TCK
H_TDI: U1401.J10(PROC_TDI) ; off-sheet H_TDI
H_TDO: U1401.K9(PROC_TDO) ; off-sheet H_TDO
H_THERMTRIP_N: R1606.1(A) U1401.C4(THERMTRIP#)
H_TMS: U1401.H9(PROC_TMS) ; off-sheet H_TMS
H_TRST_N: U1401.H10(PROC_JTAG_TRST#) ; off-sheet H_TRST_N
PCH_CPU_BCLK_R_DN: U1401.V8(BCLK_N) ; off-sheet PCH_CPU_BCLK_R_DN
PCH_CPU_BCLK_R_DP: U1401.U8(BCLK_P) ; off-sheet PCH_CPU_BCLK_R_DP
PCH_CPU_PCIBCLK_R_DN: U1401.AA10(PCI_BCLKN) ; off-sheet PCH_CPU_PCIBCLK_R_DN
PCH_CPU_PCIBCLK_R_DP: U1401.Y10(PCI_BCLKP) ; off-sheet PCH_CPU_PCIBCLK_R_DP
PCH_THERMTRIP_N: R1603.1(A) R1606.2(B) ; off-sheet PCH_THERMTRIP_N
PLTRST_CPU_N: U1401.C5(RESET#) ; off-sheet PLTRST_CPU_N
TP_CPU_ID: R1610.1(A) U1401.G32(CPU_ID)
TP_DDR_VTT_CNTL: U1401.AJ54(DDR_VTT_CTL)
TPEV_RPL_PCUDEBUG_8_TP: U1401.K13(CFG_8)
TPEV_RPL_PCUDEBUG_11_TP: U1401.H15(CFG_11)
TPEV_RPL_PCUDEBUG_12_TP: U1401.L14(CFG_12)
TPEV_RPL_PCUDEBUG_13_TP: U1401.J15(CFG_13)
TPEV_RPL_PCUDEBUG_15_TP: U1401.K15(CFG_15)
TPEV_RPL_PCUDEBUG_<0>: U1401.H11(CFG_0) ; off-sheet TPEV_RPL_PCUDEBUG_<0>
TPEV_RPL_PCUDEBUG_<1>: U1401.L12(CFG_1) ; off-sheet TPEV_RPL_PCUDEBUG_<1>
TPEV_RPL_PCUDEBUG_<2>: U1401.J11(CFG_2) ; off-sheet TPEV_RPL_PCUDEBUG_<2>
TPEV_RPL_PCUDEBUG_<3>: U1401.J12(CFG_3) ; off-sheet TPEV_RPL_PCUDEBUG_<3>
TPEV_RPL_PCUDEBUG_<4>: U1401.H13(CFG_4) ; off-sheet TPEV_RPL_PCUDEBUG_<4>
TPEV_RPL_PCUDEBUG_<5>: U1401.H12(CFG_5) ; off-sheet TPEV_RPL_PCUDEBUG_<5>
TPEV_RPL_PCUDEBUG_<6>: U1401.J13(CFG_6) ; off-sheet TPEV_RPL_PCUDEBUG_<6>
TPEV_RPL_PCUDEBUG_<7>: U1401.L13(CFG_7) ; off-sheet TPEV_RPL_PCUDEBUG_<7>
TPEV_RPL_PCUDEBUG_<9>: U1401.J14(CFG_9) ; off-sheet TPEV_RPL_PCUDEBUG_<9>
TPEV_RPL_PCUDEBUG_<10>: U1401.H14(CFG_10) ; off-sheet TPEV_RPL_PCUDEBUG_<10>
TPEV_RPL_PCUDEBUG_<14>: U1401.L15(CFG_14) ; off-sheet TPEV_RPL_PCUDEBUG_<14>
VAL_MIPI60_HOOK2_EAR: R4M49.2(B) R734.1(A) U1401.N10(EAR#) ; off-sheet VAL_MIPI60_HOOK2_EAR
VAL_RPL_PCUSTB_0: R4B51.2(B) U1401.K11(CFG_16) ; off-sheet VAL_RPL_PCUSTB_0
VAL_RPL_PCUSTB_1: R4B61.2(B) U1401.H16(CFG_17) ; off-sheet VAL_RPL_PCUSTB_1
VCCST_PWRGD: R1608.2(B) R1609.1(A) ; off-sheet VCCST_PWRGD
VCCST_PWRGD_CPU: C1603.1(A) R1609.2(B) U1401.C6(VCCST_PWRGD)
VR_SVID_ALERT_N: R1U3.1(A) R1U5.2(B) ; off-sheet VR_SVID_ALERT_N
VR_SVID_CLK: R1U1.1(A) R1U7.2(B) ; off-sheet VR_SVID_CLK
VR_SVID_DATA: R1U2.2(B) R1U4.1(A) ; off-sheet VR_SVID_DATA

Not connected (* = marked no-connect by the designer): U1401 L16(RSVD_42) L17(RSVD_43)

### Notes on the sheet
- <XR_PAGE_TITLE>
- 8
- 7
- 6
- 5
- 4
- 3
- 2
- 1
- MODULE REV DETAILS
- MODULE NAME
- REV
- DATE
- D
- CAD NOTE:
- PLACE THE PU RESISTORS
- CLOSE TO CPU. AND BREAKOUT AS 2 TRACES
- PLACE RB CLOSE TO PCH
- 16
- RB
- PLACE CLOSE TO CPU
- C
- 29
- B
- 130
- DESIGN NOTE:
- CAP FOR ESD SENSITIVE NET
- A
- PLACEHOLDER PULL DOWN ONLY
- BPAGE DRAWING
- INTEL
- DOCUMENT_NUMBER
- PAGE
- Mon Aug 29 09:40:33 2022
- h55_dg2_2dpc.GND
- CONFIDENTIAL
- 724452
- 0.9
- CUSTOM TEXT BPAGE

### Library data of the parts
C1601 = CAP: CDS_PHYS_PART_NAME: CAP_0402-A36096-046,EMPTY,1000PF,50V,10%,LPDB,GENERIC; OriginalSymbolOrigin: (-50,25); XY: (-7350,1400); VER: 1; ROT: 0; PHYS_PAGE: 16; LOCATION: C1601; IP: GENERIC; FP_TECH: LPDB; DRAWING: @RVP1_ADL_SB_ADP_S_DDR5_SODIMM_2DPC_LIB.H55_DG2_2DPC(SCH_1):PAGE16; CDS_LIB: discrete; PCB Footprint: SMC0402IA; SEC_TYPE: 0402; CHIPS_PART_NAME: CAP; CDS_PART_NAME: CAP_0402-A36096-046,EMPTY,1000PF,50V,10%,LPDB,GENERIC; CDS_LOCATION: C1601; ASI_MODEL: A36096-046
C1602 = CAP: CDS_PHYS_PART_NAME: CAP_0402-A36096-046,EMPTY,1000PF,50V,10%,LPDB,GENERIC; OriginalSymbolOrigin: (-50,25); XY: (-5875,3475); VER: 1; ROT: 0; PHYS_PAGE: 16; LOCATION: C1602; IP: GENERIC; FP_TECH: LPDB; DRAWING: @RVP1_ADL_SB_ADP_S_DDR5_SODIMM_2DPC_LIB.H55_DG2_2DPC(SCH_1):PAGE16; CDS_LIB: discrete; PCB Footprint: SMC0402IA; SEC_TYPE: 0402; CHIPS_PART_NAME: CAP; CDS_PART_NAME: CAP_0402-A36096-046,EMPTY,1000PF,50V,10%,LPDB,GENERIC; CDS_LOCATION: C1602; ASI_MODEL: A36096-046
C1603 = CAP: CDS_PHYS_PART_NAME: CAP_0402-A36096-046,EMPTY,1000PF,50V,10%,LPDB,GENERIC; OriginalSymbolOrigin: (-50,25); XY: (-3150,950); VER: 1; ROT: 0; PHYS_PAGE: 16; LOCATION: C1603; IP: GENERIC; FP_TECH: LPDB; DRAWING: @RVP1_ADL_SB_ADP_S_DDR5_SODIMM_2DPC_LIB.H55_DG2_2DPC(SCH_1):PAGE16; CDS_LIB: discrete; PCB Footprint: SMC0402IA; SEC_TYPE: 0402; CHIPS_PART_NAME: CAP; CDS_PART_NAME: CAP_0402-A36096-046,EMPTY,1000PF,50V,10%,LPDB,GENERIC; CDS_LOCATION: C1603; ASI_MODEL: A36096-046
CR1601 = DIODE_SCHOTTKY_2: CDS_PHYS_PART_NAME: DIODE_SCHOTTKY_2_SM-K37030-001,DIO,DB2G32600L1,1A,TK0,GENERIC; BOM_USE: STUFF; CDS_LMAN_SYM_OUTLINE: -50,100,50,-100; FP_TECH: TK0; IP: GENERIC; PACK_TYPE: SM; ROOM: NONE; OriginalSymbolOrigin: (-75,50); XY: (-6200,1100); VER: 1; ROT: 0; PHYS_PAGE: 16; LOCATION: CR1601; DRAWING: @RVP1_ADL_SB_ADP_S_DDR5_SODIMM_2DPC_LIB.H55_DG2_2DPC(SCH_1):PAGE16; CDS_LIB: local; VARIANT: ?; PCB Footprint: TK0_SCR0402_1050X650_MA; CHIPS_PART_NAME: DIODE_SCHOTTKY_2; CDS_PART_NAME: DIODE_SCHOTTKY_2_SM-K37030-001,DIO,DB2G32600L1,1A,TK0,GENERIC; CDS_LOCATION: CR1601
R1U1 = C_RES#1: PART_NUMBER: C48657-027; CHIPS_PART_NAME: C_RES; CDS_PHYS_PART_NAME: C_RES_0201-C48657-027,RES,0,1%,0.05W,TK2,GENERIC; CDS_LMAN_SYM_OUTLINE: -50,50,50,-50; FP_TECH: TK2; IP: GENERIC; ROOM: NONE; WATTAGE: 0.05W; OriginalSymbolOrigin: (-75,25); XY: (-4600,3800); VER: 1; PHYS_PAGE: 16; LOCATION: R1U1; DRAWING: @RVP1_ADL_SB_ADP_S_DDR5_SODIMM_2DPC_LIB.H55_DG2_2DPC(SCH_1):PAGE16; CDS_LIB: c_discrete; VARIANT: ?; PCB Footprint: CTK2_SM0201_630X330_MA; ROT: 0; CDS_PART_NAME: C_RES_0201-C48657-027,RES,0,1%,0.05W,TK2,GENERIC; CDS_LOCATION: R1U1
R1U2 = C_RES#1: PART_NUMBER: D93252-001; CHIPS_PART_NAME: C_RES; CDS_PHYS_PART_NAME: C_RES_0201-D93252-001,RES,100,1%,0.05W,TK2,GENERIC; CDS_LMAN_SYM_OUTLINE: -50,50,50,-50; FP_TECH: TK2; IP: GENERIC; ROOM: NONE; WATTAGE: 0.05W; OriginalSymbolOrigin: (-75,25); XY: (-6475,3950); VER: 1; ROT: 0; PHYS_PAGE: 16; LOCATION: R1U2; DRAWING: @RVP1_ADL_SB_ADP_S_DDR5_SODIMM_2DPC_LIB.H55_DG2_2DPC(SCH_1):PAGE16; CDS_LIB: c_discrete; VARIANT: ?; PCB Footprint: CTK2_SM0201_630X330_MA; CDS_PART_NAME: C_RES_0201-D93252-001,RES,100,1%,0.05W,TK2,GENERIC; CDS_LOCATION: R1U2
R1U3 = C_RES#1: PART_NUMBER: H30143-016; CHIPS_PART_NAME: C_RES; CDS_PHYS_PART_NAME: C_RES_0201-H30143-016,RES,220,5%,0.05W,TK2,GENERIC; CDS_LMAN_SYM_OUTLINE: -50,50,50,-50; FP_TECH: TK2; IP: GENERIC; ROOM: NONE; WATTAGE: 0.05W; OriginalSymbolOrigin: (-75,25); XY: (-4575,3700); VER: 1; ROT: 0; PHYS_PAGE: 16; LOCATION: R1U3; DRAWING: @RVP1_ADL_SB_ADP_S_DDR5_SODIMM_2DPC_LIB.H55_DG2_2DPC(SCH_1):PAGE16; CDS_LIB: c_discrete; VARIANT: ?; PCB Footprint: CTK2_SM0201_630X330_MA; CDS_PART_NAME: C_RES_0201-H30143-016,RES,220,5%,0.05W,TK2,GENERIC; CDS_LOCATION: R1U3
R1U4 = C_RES#1: PART_NUMBER: C48657-027; CHIPS_PART_NAME: C_RES; CDS_PHYS_PART_NAME: C_RES_0201-C48657-027,RES,0,1%,0.05W,TK2,GENERIC; CDS_LMAN_SYM_OUTLINE: -50,50,50,-50; FP_TECH: TK2; IP: GENERIC; ROOM: NONE; WATTAGE: 0.05W; OriginalSymbolOrigin: (-75,25); XY: (-4850,3750); VER: 1; PHYS_PAGE: 16; LOCATION: R1U4; DRAWING: @RVP1_ADL_SB_ADP_S_DDR5_SODIMM_2DPC_LIB.H55_DG2_2DPC(SCH_1):PAGE16; CDS_LIB: c_discrete; VARIANT: ?; PCB Footprint: CTK2_SM0201_630X330_MA; ROT: 0; CDS_PART_NAME: C_RES_0201-C48657-027,RES,0,1%,0.05W,TK2,GENERIC; CDS_LOCATION: R1U4
R1U5 = C_RES#1: PART_NUMBER: K52093-001; CHIPS_PART_NAME: C_RES; CDS_PHYS_PART_NAME: C_RES_0201-K52093-001,RES,56,1%,0.05W,TK2,GENERIC; CDS_LMAN_SYM_OUTLINE: -50,50,50,-50; FP_TECH: TK2; IP: GENERIC; ROOM: NONE; WATTAGE: 0.05W; OriginalSymbolOrigin: (-75,25); XY: (-6075,3875); VER: 1; ROT: 0; PHYS_PAGE: 16; LOCATION: R1U5; DRAWING: @RVP1_ADL_SB_ADP_S_DDR5_SODIMM_2DPC_LIB.H55_DG2_2DPC(SCH_1):PAGE16; CDS_LIB: c_discrete; VARIANT: ?; PCB Footprint: CTK2_SM0201_650X350_MA; CDS_PART_NAME: C_RES_0201-K52093-001,RES,56,1%,0.05W,TK2,GENERIC; CDS_LOCATION: R1U5
R1U7 = C_RES#1: PART_NUMBER: C48657-209; CHIPS_PART_NAME: C_RES; CDS_PHYS_PART_NAME: C_RES_0201-C48657-209,EMPTY,45.3,1%,0.05W,TK2,GENERIC; CDS_LMAN_SYM_OUTLINE: -50,50,50,-50; FP_TECH: TK2; IP: GENERIC; ROOM: NONE; WATTAGE: 0.05W; OriginalSymbolOrigin: (-75,25); XY: (-6875,4025); VER: 1; ROT: 0; PHYS_PAGE: 16; LOCATION: R1U7; DRAWING: @RVP1_ADL_SB_ADP_S_DDR5_SODIMM_2DPC_LIB.H55_DG2_2DPC(SCH_1):PAGE16; CDS_LIB: c_discrete; VARIANT: ?; PCB Footprint: CTK2_SM0201_650X350_MA; CDS_PART_NAME: C_RES_0201-C48657-209,EMPTY,45.3,1%,0.05W,TK2,GENERIC; CDS_LOCATION: R1U7
R4B45 = C_RES: CDS_PHYS_PART_NAME: C_RES_0201-C80792-002,RES,10K,5%,0.05W,TK2,GENERIC; CDS_LMAN_SYM_OUTLINE: -50,50,50,-50; FP_TECH: TK2; IP: GENERIC; ROOM: NONE; OriginalSymbolOrigin: (-25,75); XY: (-1475,550); VER: 2; ROT: 0; PHYS_PAGE: 16; LOCATION: R4B45; DRAWING: @RVP1_ADL_SB_ADP_S_DDR5_SODIMM_2DPC_LIB.H55_DG2_2DPC(SCH_1):PAGE16; CDS_LIB: c_discrete; VARIANT: ?; PCB Footprint: CTK2_SM0201_630X330_MA; CHIPS_PART_NAME: C_RES; CDS_PART_NAME: C_RES_0201-C80792-002,RES,10K,5%,0.05W,TK2,GENERIC; CDS_LOCATION: R4B45
R4B49 = C_RES: CDS_PHYS_PART_NAME: C_RES_0201-C80792-002,RES,10K,5%,0.05W,TK2,GENERIC; CDS_LMAN_SYM_OUTLINE: -50,50,50,-50; FP_TECH: TK2; IP: GENERIC; ROOM: NONE; OriginalSymbolOrigin: (-25,75); XY: (-1475,2075); VER: 2; ROT: 0; PHYS_PAGE: 16; LOCATION: R4B49; DRAWING: @RVP1_ADL_SB_ADP_S_DDR5_SODIMM_2DPC_LIB.H55_DG2_2DPC(SCH_1):PAGE16; CDS_LIB: c_discrete; VARIANT: ?; PCB Footprint: CTK2_SM0201_630X330_MA; CHIPS_PART_NAME: C_RES; CDS_PART_NAME: C_RES_0201-C80792-002,RES,10K,5%,0.05W,TK2,GENERIC; CDS_LOCATION: R4B49
R4B51 = C_RES: CDS_PHYS_PART_NAME: C_RES_0201-C80792-012,EMPTY,1K,5%,0.05W,TK2,GENERIC; CDS_LMAN_SYM_OUTLINE: -50,50,50,-50; FP_TECH: TK2; IP: GENERIC; ROOM: NONE; OriginalSymbolOrigin: (-25,75); XY: (-350,4025); VER: 2; ROT: 0; PHYS_PAGE: 16; LOCATION: R4B51; DRAWING: @RVP1_ADL_SB_ADP_S_DDR5_SODIMM_2DPC_LIB.H55_DG2_2DPC(SCH_1):PAGE16; CDS_LIB: c_discrete; VARIANT: ?; PCB Footprint: CTK2_SM0201_630X330_MA; CHIPS_PART_NAME: C_RES; CDS_PART_NAME: C_RES_0201-C80792-012,EMPTY,1K,5%,0.05W,TK2,GENERIC; CDS_LOCATION: R4B51
R4B59 = C_RES: CDS_PHYS_PART_NAME: C_RES_0201-C80792-002,RES,10K,5%,0.05W,TK2,GENERIC; CDS_LMAN_SYM_OUTLINE: -50,50,50,-50; FP_TECH: TK2; IP: GENERIC; ROOM: NONE; OriginalSymbolOrigin: (-25,75); XY: (-1475,1575); VER: 2; ROT: 0; PHYS_PAGE: 16; LOCATION: R4B59; DRAWING: @RVP1_ADL_SB_ADP_S_DDR5_SODIMM_2DPC_LIB.H55_DG2_2DPC(SCH_1):PAGE16; CDS_LIB: c_discrete; VARIANT: ?; PCB Footprint: CTK2_SM0201_630X330_MA; CHIPS_PART_NAME: C_RES; CDS_PART_NAME: C_RES_0201-C80792-002,RES,10K,5%,0.05W,TK2,GENERIC; CDS_LOCATION: R4B59
R4B61 = C_RES: CDS_PHYS_PART_NAME: C_RES_0201-C80792-012,EMPTY,1K,5%,0.05W,TK2,GENERIC; CDS_LMAN_SYM_OUTLINE: -50,50,50,-50; FP_TECH: TK2; IP: GENERIC; ROOM: NONE; OriginalSymbolOrigin: (-25,75); XY: (-750,4025); VER: 2; ROT: 0; PHYS_PAGE: 16; LOCATION: R4B61; DRAWING: @RVP1_ADL_SB_ADP_S_DDR5_SODIMM_2DPC_LIB.H55_DG2_2DPC(SCH_1):PAGE16; CDS_LIB: c_discrete; VARIANT: ?; PCB Footprint: CTK2_SM0201_630X330_MA; CHIPS_PART_NAME: C_RES; CDS_PART_NAME: C_RES_0201-C80792-012,EMPTY,1K,5%,0.05W,TK2,GENERIC; CDS_LOCATION: R4B61
R4B63 = C_RES: CDS_PHYS_PART_NAME: C_RES_0201-C80792-002,RES,10K,5%,0.05W,TK2,GENERIC; CDS_LMAN_SYM_OUTLINE: -50,50,50,-50; FP_TECH: TK2; IP: GENERIC; ROOM: NONE; OriginalSymbolOrigin: (-25,75); XY: (-1500,1050); VER: 2; ROT: 0; PHYS_PAGE: 16; LOCATION: R4B63; DRAWING: @RVP1_ADL_SB_ADP_S_DDR5_SODIMM_2DPC_LIB.H55_DG2_2DPC(SCH_1):PAGE16; CDS_LIB: c_discrete; VARIANT: ?; PCB Footprint: CTK2_SM0201_630X330_MA; CHIPS_PART_NAME: C_RES; CDS_PART_NAME: C_RES_0201-C80792-002,RES,10K,5%,0.05W,TK2,GENERIC; CDS_LOCATION: R4B63
R4M49 = RES#1: PART_NUMBER: A93549-016; CHIPS_PART_NAME: RES; CDS_PHYS_PART_NAME: RES_0402-A93549-016,CHIP,1K,5%,1/16W,LPDB,GENERIC; WATTAGE: 1/16W; OriginalSymbolOrigin: (-75,25); XY: (-5300,2525); VER: 1; ROT: 3; PHYS_PAGE: 16; LOCATION: R4M49; DRAWING: @RVP1_ADL_SB_ADP_S_DDR5_SODIMM_2DPC_LIB.H55_DG2_2DPC(SCH_1):PAGE16; CDS_LIB: discrete; PCB Footprint: SMR0402IA; CDS_PART_NAME: RES_0402-A93549-016,CHIP,1K,5%,1/16W,LPDB,GENERIC; CDS_LOCATION: R4M49; ASI_MODEL: A93549-016
R401 = RES_2: CDS_PHYS_PART_NAME: RES_2_0402-A93549-016,RES,1K,5%,1/16W,TK0,GENERIC; CDS_LMAN_SYM_OUTLINE: -50,50,50,-50; FP_TECH: TK0; IP: GENERIC; ROOM: NONE; OriginalSymbolOrigin: (-25,75); XY: (-4725,2425); VER: 2; ROT: 0; PHYS_PAGE: 16; LOCATION: R401; DRAWING: @RVP1_ADL_SB_ADP_S_DDR5_SODIMM_2DPC_LIB.H55_DG2_2DPC(SCH_1):PAGE16; CDS_LIB: discrete_2; VARIANT: ?; PCB Footprint: TK0_SM0402_1100X550_MC; CHIPS_PART_NAME: RES_2; CDS_PART_NAME: RES_2_0402-A93549-016,RES,1K,5%,1/16W,TK0,GENERIC; CDS_LOCATION: R401
R734 = RES: CDS_PHYS_PART_NAME: RES_0201-H74132-007,EMPTY,1K,1%,1/20W,LPDB,GENERIC; OriginalSymbolOrigin: (-25,75); XY: (-5300,2225); VER: 2; ROT: 0; PHYS_PAGE: 16; LOCATION: R734; FP_TECH: LPDB; DRAWING: @RVP1_ADL_SB_ADP_S_DDR5_SODIMM_2DPC_LIB.H55_DG2_2DPC(SCH_1):PAGE16; CDS_LIB: discrete; PCB Footprint: SMR0201IA; SEC_TYPE: 0201; CHIPS_PART_NAME: RES; CDS_PART_NAME: RES_0201-H74132-007,EMPTY,1K,1%,1/20W,LPDB,GENERIC; CDS_LOCATION: R734
R1601 = RES#1: CHIPS_PART_NAME: RES; CDS_PHYS_PART_NAME: RES_0402-A93548-094,CHIP,499,1%,1/16W,LPDB,GENERIC; WATTAGE: 1/16W; OriginalSymbolOrigin: (-75,25); XY: (-7000,1600); VER: 1; ROT: 0; PHYS_PAGE: 16; LOCATION: R1601; IP: GENERIC; FP_TECH: LPDB; FIN: CPU; DRAWING: @RVP1_ADL_SB_ADP_S_DDR5_SODIMM_2DPC_LIB.H55_DG2_2DPC(SCH_1):PAGE16; CDS_LIB: discrete; PCB Footprint: SMR0402IA; SEC_TYPE: 0402; CDS_PART_NAME: RES_0402-A93548-094,CHIP,499,1%,1/16W,LPDB,GENERIC; CDS_LOCATION: R1601; ASI_MODEL: A93548-094
R1602 = RES#1: CHIPS_PART_NAME: RES; CDS_PHYS_PART_NAME: RES_0402-A93549-030,CHIP,20,5%,1/16W,LPDB,GENERIC; WATTAGE: 1/16W; OriginalSymbolOrigin: (-75,25); XY: (-7000,900); VER: 1; ROT: 0; PHYS_PAGE: 16; LOCATION: R1602; IP: GENERIC; FP_TECH: LPDB; DRAWING: @RVP1_ADL_SB_ADP_S_DDR5_SODIMM_2DPC_LIB.H55_DG2_2DPC(SCH_1):PAGE16; CDS_LIB: discrete; PCB Footprint: SMR0402IA; SEC_TYPE: 0402; CDS_PART_NAME: RES_0402-A93549-030,CHIP,20,5%,1/16W,LPDB,GENERIC; CDS_LOCATION: R1602; ASI_MODEL: A93549-030
R1603 = RES#1: CHIPS_PART_NAME: RES; CDS_PHYS_PART_NAME: RES_0402-A93549-016,CHIP,1K,5%,1/16W,LPDB,GENERIC; WATTAGE: 1/16W; OriginalSymbolOrigin: (-75,25); XY: (-7250,3500); VER: 1; PHYS_PAGE: 16; LOCATION: R1603; IP: GENERIC; FP_TECH: LPDB; FIN: CPU; DRAWING: @RVP1_ADL_SB_ADP_S_DDR5_SODIMM_2DPC_LIB.H55_DG2_2DPC(SCH_1):PAGE16; CDS_LIB: discrete; PCB Footprint: SMR0402IA; ROT: 1; CDS_PART_NAME: RES_0402-A93549-016,CHIP,1K,5%,1/16W,LPDB,GENERIC; CDS_LOCATION: R1603; ASI_MODEL: A93549-016
R1604 = RES: CDS_PHYS_PART_NAME: RES_0402-A36093-016,EMPTY,1K,5%,1/16W,LPDB,GENERIC; WATTAGE: 1/16W; OriginalSymbolOrigin: (-25,75); XY: (-6650,625); VER: 2; ROT: 0; PHYS_PAGE: 16; LOCATION: R1604; IP: GENERIC; FP_TECH: LPDB; FIN: DEBUG; DRAWING: @RVP1_ADL_SB_ADP_S_DDR5_SODIMM_2DPC_LIB.H55_DG2_2DPC(SCH_1):PAGE16; CDS_LIB: discrete; PCB Footprint: SMR0402IA; CHIPS_PART_NAME: RES; CDS_PART_NAME: RES_0402-A36093-016,EMPTY,1K,5%,1/16W,LPDB,GENERIC; CDS_LOCATION: R1604; ASI_MODEL: A36093-016
R1605 = RES: CDS_PHYS_PART_NAME: RES_0402-A93548-023,CHIP,1K,1%,1/16W,LPDB,GENERIC; WATTAGE: 1/16W; OriginalSymbolOrigin: (-25,75); XY: (-6600,1850); VER: 2; PHYS_PAGE: 16; LOCATION: R1605; IP: GENERIC; FP_TECH: LPDB; FIN: CPU; DRAWING: @RVP1_ADL_SB_ADP_S_DDR5_SODIMM_2DPC_LIB.H55_DG2_2DPC(SCH_1):PAGE16; CDS_LIB: discrete; PCB Footprint: SMR0402IA; ROT: 2; CHIPS_PART_NAME: RES; CDS_PART_NAME: RES_0402-A93548-023,CHIP,1K,1%,1/16W,LPDB,GENERIC; CDS_LOCATION: R1605; ASI_MODEL: A93548-023
R1606 = RES#1: CHIPS_PART_NAME: RES; CDS_PHYS_PART_NAME: RES_0402-A93549-001,CHIP,0,5%,1/16W,LPDB,GENERIC; WATTAGE: 1/16W; OriginalSymbolOrigin: (-75,25); XY: (-6350,3100); VER: 1; ROT: 2; PHYS_PAGE: 16; LOCATION: R1606; IP: GENERIC; FP_TECH: LPDB; FIN: CPU; DRAWING: @RVP1_ADL_SB_ADP_S_DDR5_SODIMM_2DPC_LIB.H55_DG2_2DPC(SCH_1):PAGE16; CDS_LIB: discrete; PCB Footprint: SMR0402IA; CDS_PART_NAME: RES_0402-A93549-001,CHIP,0,5%,1/16W,LPDB,GENERIC; CDS_LOCATION: R1606; ASI_MODEL: A93549-001
R1607 = RES#1: PART_NUMBER: A93549-001; CHIPS_PART_NAME: RES; CDS_PHYS_PART_NAME: RES_0402-A93549-001,EMPTY,0,5%,1/16W,LPDB,GENERIC; WATTAGE: 1/16W; OriginalSymbolOrigin: (-75,25); XY: (-6225,1425); VER: 1; PHYS_PAGE: 16; LOCATION: R1607; IP: GENERIC; FP_TECH: LPDB; DRAWING: @RVP1_ADL_SB_ADP_S_DDR5_SODIMM_2DPC_LIB.H55_DG2_2DPC(SCH_1):PAGE16; CDS_LIB: discrete; PCB Footprint: SMR0402IA; ROT: 0; CDS_PART_NAME: RES_0402-A93549-001,EMPTY,0,5%,1/16W,LPDB,GENERIC; CDS_LOCATION: R1607
R1608 = RES: CDS_PHYS_PART_NAME: RES_0402-A93548-023,CHIP,1K,1%,1/16W,LPDB,GENERIC; WATTAGE: 1/16W; OriginalSymbolOrigin: (-25,75); XY: (-3800,1400); VER: 2; PHYS_PAGE: 16; LOCATION: R1608; IP: GENERIC; FP_TECH: LPDB; FIN: DEBUG; DRAWING: @RVP1_ADL_SB_ADP_S_DDR5_SODIMM_2DPC_LIB.H55_DG2_2DPC(SCH_1):PAGE16; CDS_LIB: discrete; PCB Footprint: SMR0402IA; ROT: 2; CHIPS_PART_NAME: RES; CDS_PART_NAME: RES_0402-A93548-023,CHIP,1K,1%,1/16W,LPDB,GENERIC; CDS_LOCATION: R1608; ASI_MODEL: A93548-023
R1609 = RES#1: CHIPS_PART_NAME: RES; CDS_PHYS_PART_NAME: RES_0402-A93549-077,CHIP,62,5%,1/16W,LPDB,GENERIC; WATTAGE: 1/16W; OriginalSymbolOrigin: (-75,25); XY: (-3500,1150); VER: 1; ROT: 0; PHYS_PAGE: 16; LOCATION: R1609; IP: GENERIC; FP_TECH: LPDB; DRAWING: @RVP1_ADL_SB_ADP_S_DDR5_SODIMM_2DPC_LIB.H55_DG2_2DPC(SCH_1):PAGE16; CDS_LIB: discrete; PCB Footprint: SMR0402IA; CDS_PART_NAME: RES_0402-A93549-077,CHIP,62,5%,1/16W,LPDB,GENERIC; CDS_LOCATION: R1609; ASI_MODEL: A93549-077
R1610 = RES#1: CHIPS_PART_NAME: RES; CDS_PHYS_PART_NAME: RES_0402-A93549-023,CHIP,10K,5%,1/16W,LPDB,GENERIC; WATTAGE: 1/16W; OriginalSymbolOrigin: (-75,25); XY: (-2000,2400); VER: 1; ROT: 0; PHYS_PAGE: 16; LOCATION: R1610; IP: GENERIC; FP_TECH: LPDB; FIN: EC; DRAWING: @RVP1_ADL_SB_ADP_S_DDR5_SODIMM_2DPC_LIB.H55_DG2_2DPC(SCH_1):PAGE16; CDS_LIB: discrete; PCB Footprint: SMR0402IA; CDS_PART_NAME: RES_0402-A93549-023,CHIP,10K,5%,1/16W,LPDB,GENERIC; CDS_LOCATION: R1610; ASI_MODEL: A93549-023
R1611 = C_RES: PART_NUMBER: A93549-027; CDS_PHYS_PART_NAME: C_RES_0402-A93549-027,RES,100K,5%,0.0625W,TK2,GENERIC; CDS_LMAN_SYM_OUTLINE: -50,50,50,-50; FP_TECH: TK2; IP: GENERIC; ROOM: NONE; WATTAGE: 0.0625W; OriginalSymbolOrigin: (-25,75); XY: (-5050,1450); VER: 2; ROT: 0; PHYS_PAGE: 16; LOCATION: R1611; DRAWING: @RVP1_ADL_SB_ADP_S_DDR5_SODIMM_2DPC_LIB.H55_DG2_2DPC(SCH_1):PAGE16; CDS_LIB: c_discrete; VARIANT: ?; PCB Footprint: CTK2_SM0402_1100X550_MA; CHIPS_PART_NAME: C_RES; CDS_PART_NAME: C_RES_0402-A93549-027,RES,100K,5%,0.0625W,TK2,GENERIC; CDS_LOCATION: R1611
U1401 = C_RPL_HX_EXT: CDS_PHYS_PART_NAME: C_RPL_HX_EXT_BGA-NA_81935,IC,RPL_HX_EXT,0.8,LPDB,GENERIC; CDS_LMAN_SYM_OUTLINE: -350,1400,350,-1350; FP_TECH: LPDB; IP: GENERIC; PACK_TYPE: BGA; ROOM: NONE; OriginalSymbolOrigin: (-375,1400); CaptureCellPackProp: C_RPL_HX_EXTE; XY: (-3250,3550); VER: 5; ROT: 0; PHYS_PAGE: 16; LOCATION: U1401; DRAWING: @RVP1_ADL_SB_ADP_S_DDR5_SODIMM_2DPC_LIB.H55_DG2_2DPC(SCH_1):PAGE16; CDS_LIB: local; VARIANT: ?; PCB Footprint: CLPDB_BGA1964_RPL_HX_LP7530_MA; SEC_TYPE: BGA; CHIPS_PART_NAME: C_RPL_HX_EXT; CDS_PART_NAME: C_RPL_HX_EXT_BGA-NA_81935,IC,RPL_HX_EXT,0.8,LPDB,GENERIC; CDS_LOCATION: U1401

## Sheet 0017_Processor - MISC.SchDoc
size A3
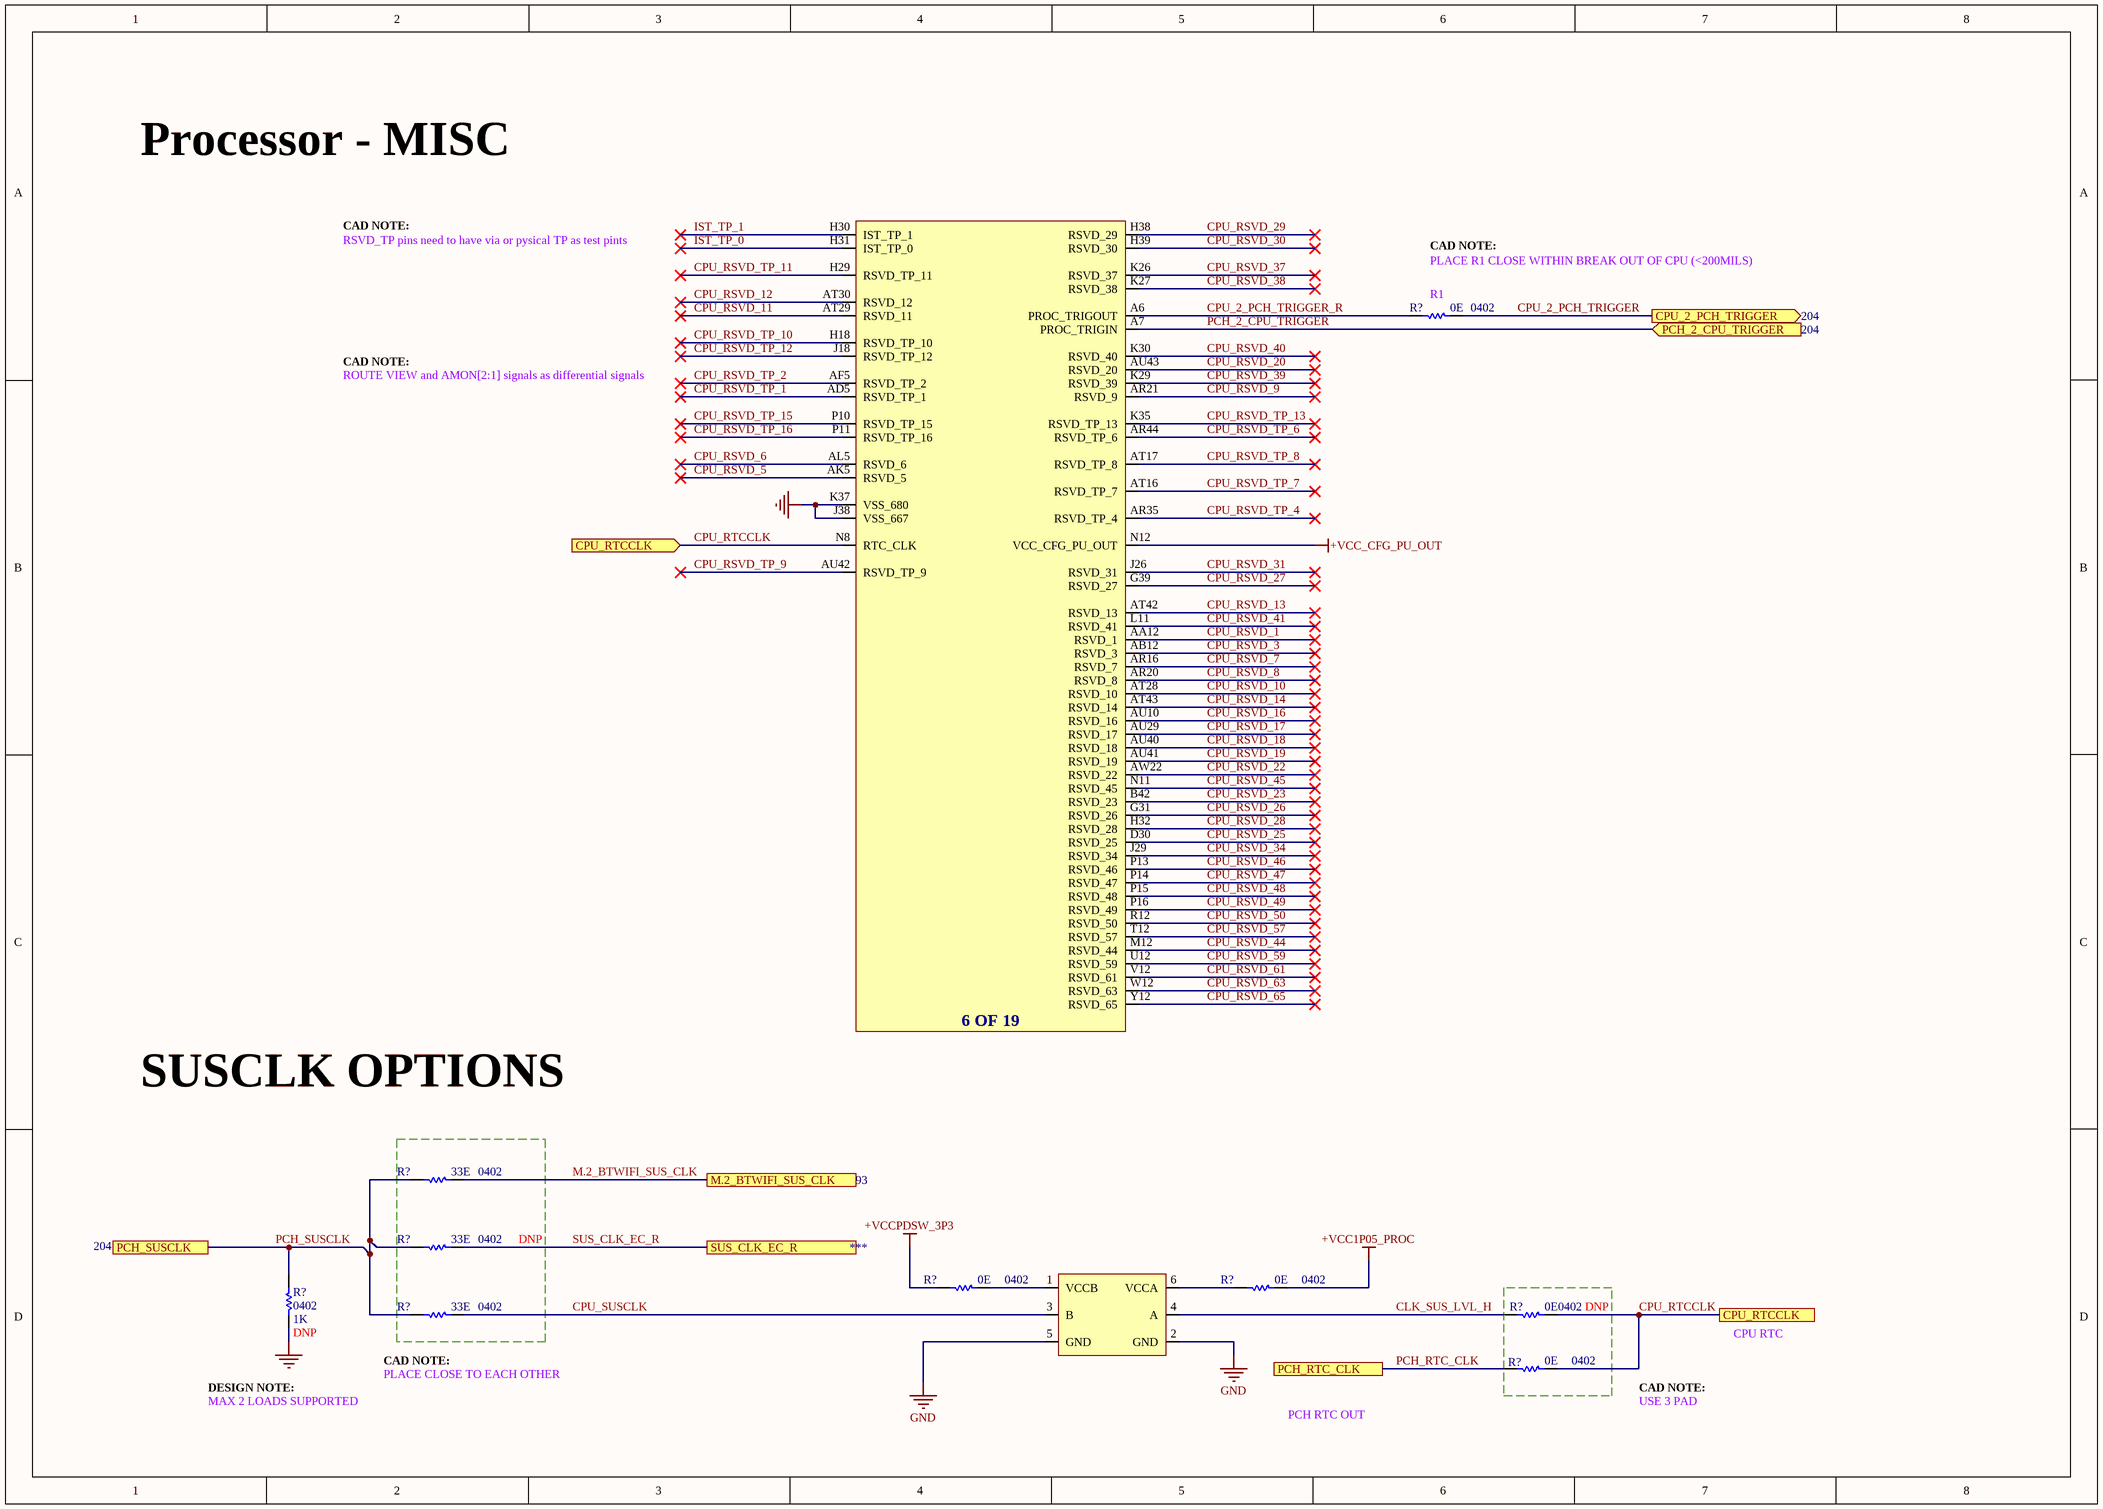
[diagram p46: 0017_Processor - MISC.SchDoc]

### Parts
(Parts that share a designator on the sheet are numbered #1, #2 ... from top to bottom, then left to right.)
R?#34  value 0E  Case/Package: 0402  [RESC0402]  (hidden comment: Res)
R?#35  value 33E  Case/Package: 0402  [RESC0402]  (hidden comment: Res)
R?#36  value 33E  Case/Package: 0402  [RESC0402]  (hidden comment: Res)
R?#37  value 0E  Case/Package: 0402  [RESC0402]  (hidden comment: Res)
R?#38  value 0E  Case/Package: 0402  [RESC0402]  (hidden comment: Res)
R?#39  value 1K  Case/Package: 0402  [RESC0402]  (hidden comment: Res)
R?#40  value 33E  Case/Package: 0402  [RESC0402]  (hidden comment: Res)
R?#41  value 0E  Case/Package: 0402  [RESC0402]  (hidden comment: Res)
R?#42  value 0E  Case/Package: 0402  [RESC0402]  (hidden comment: Res)
U?#1  C_RPL_HX_EXT  (value not drawn)  (part F of 19)
U?#2  TTL1T45  (value not drawn)

### Ports
CPU_2_PCH_TRIGGER (out), CPU_RTCCLK, CPU_RTCCLK (in), M.2_BTWIFI_SUS_CLK, PCH_2_CPU_TRIGGER (in), PCH_RTC_CLK, PCH_SUSCLK, SUS_CLK_EC_R

### Nets
+VCC1P05_PROC: R?#38.2
+VCC_CFG_PU_OUT: U?#1.N12(VCC_CFG_PU_OUT)
+VCCPDSW_3P3: R?#37.1
GND: R?#39.1 U?#1.J38(VSS_667) U?#1.K37(VSS_680) U?#2.2(GND) U?#2.5(GND)  [project net EXP_A_RX_4_DP]
CLK_SUS_LVL_H: R?#41.1 U?#2.4(A)
CPU_2_PCH_TRIGGER: R?#34.2 ; port CPU_2_PCH_TRIGGER
CPU_2_PCH_TRIGGER_R: R?#34.1 U?#1.A6(PROC_TRIGOUT)
CPU_RSVD_1: U?#1.AA12(RSVD_1)
CPU_RSVD_3: U?#1.AB12(RSVD_3)
CPU_RSVD_5: U?#1.AK5(RSVD_5)
CPU_RSVD_6: U?#1.AL5(RSVD_6)
CPU_RSVD_7: U?#1.AR16(RSVD_7)
CPU_RSVD_8: U?#1.AR20(RSVD_8)
CPU_RSVD_9: U?#1.AR21(RSVD_9)
CPU_RSVD_10: U?#1.AT28(RSVD_10)
CPU_RSVD_11: U?#1.AT29(RSVD_11)
CPU_RSVD_12: U?#1.AT30(RSVD_12)
CPU_RSVD_13: U?#1.AT42(RSVD_13)
CPU_RSVD_14: U?#1.AT43(RSVD_14)
CPU_RSVD_16: U?#1.AU10(RSVD_16)
CPU_RSVD_17: U?#1.AU29(RSVD_17)
CPU_RSVD_18: U?#1.AU40(RSVD_18)
CPU_RSVD_19: U?#1.AU41(RSVD_19)
CPU_RSVD_20: U?#1.AU43(RSVD_20)
CPU_RSVD_22: U?#1.AW22(RSVD_22)
CPU_RSVD_23: U?#1.B42(RSVD_23)
CPU_RSVD_25: U?#1.D30(RSVD_25)
CPU_RSVD_26: U?#1.G31(RSVD_26)
CPU_RSVD_27: U?#1.G39(RSVD_27)
CPU_RSVD_28: U?#1.H32(RSVD_28)
CPU_RSVD_29: U?#1.H38(RSVD_29)
CPU_RSVD_30: U?#1.H39(RSVD_30)
CPU_RSVD_31: U?#1.J26(RSVD_31)
CPU_RSVD_34: U?#1.J29(RSVD_34)
CPU_RSVD_37: U?#1.K26(RSVD_37)
CPU_RSVD_38: U?#1.K27(RSVD_38)
CPU_RSVD_39: U?#1.K29(RSVD_39)
CPU_RSVD_40: U?#1.K30(RSVD_40)
CPU_RSVD_41: U?#1.L11(RSVD_41)
CPU_RSVD_44: U?#1.M12(RSVD_44)
CPU_RSVD_45: U?#1.N11(RSVD_45)
CPU_RSVD_46: U?#1.P13(RSVD_46)
CPU_RSVD_47: U?#1.P14(RSVD_47)
CPU_RSVD_48: U?#1.P15(RSVD_48)
CPU_RSVD_49: U?#1.P16(RSVD_49)
CPU_RSVD_50: U?#1.R12(RSVD_50)
CPU_RSVD_57: U?#1.T12(RSVD_57)
CPU_RSVD_59: U?#1.U12(RSVD_59)
CPU_RSVD_61: U?#1.V12(RSVD_61)
CPU_RSVD_63: U?#1.W12(RSVD_63)
CPU_RSVD_65: U?#1.Y12(RSVD_65)
CPU_RSVD_TP_1: U?#1.AD5(RSVD_TP_1)
CPU_RSVD_TP_2: U?#1.AF5(RSVD_TP_2)
CPU_RSVD_TP_4: U?#1.AR35(RSVD_TP_4)
CPU_RSVD_TP_6: U?#1.AR44(RSVD_TP_6)
CPU_RSVD_TP_7: U?#1.AT16(RSVD_TP_7)
CPU_RSVD_TP_8: U?#1.AT17(RSVD_TP_8)
CPU_RSVD_TP_9: U?#1.AU42(RSVD_TP_9)
CPU_RSVD_TP_10: U?#1.H18(RSVD_TP_10)
CPU_RSVD_TP_11: U?#1.H29(RSVD_TP_11)
CPU_RSVD_TP_12: U?#1.J18(RSVD_TP_12)
CPU_RSVD_TP_13: U?#1.K35(RSVD_TP_13)
CPU_RSVD_TP_15: U?#1.P10(RSVD_TP_15)
CPU_RSVD_TP_16: U?#1.P11(RSVD_TP_16)
CPU_RTCCLK: R?#41.2 R?#42.2 U?#1.N8(RTC_CLK) ; port CPU_RTCCLK
CPU_SUSCLK: R?#40.2 U?#2.3(B)
IST_TP_0: U?#1.H31(IST_TP_0)
IST_TP_1: U?#1.H30(IST_TP_1)
M.2_BTWIFI_SUS_CLK: R?#35.2 ; port M.2_BTWIFI_SUS_CLK
PCH_2_CPU_TRIGGER: U?#1.A7(PROC_TRIGIN) ; port PCH_2_CPU_TRIGGER
PCH_RTC_CLK: R?#42.1 ; port PCH_RTC_CLK
PCH_SUSCLK: R?#35.1 R?#36.1 R?#39.2 R?#40.1 ; port PCH_SUSCLK
SUS_CLK_EC_R: R?#36.2 ; port SUS_CLK_EC_R
NetR?#37_2: R?#37.2 U?#2.1(VCCB)
NetR?#38_1: R?#38.1 U?#2.6(VCCA)

### Notes on the sheet
- Processor - MISC
- CAD NOTE:
- RSVD_TP pins need to have via or pysical TP as test pints
- (near R?#34) PLACE R1 CLOSE WITHIN BREAK OUT OF CPU (<200MILS)
- (near R?#34) R1
- ROUTE VIEW and AMON[2:1] signals as differential signals
- SUSCLK OPTIONS
- DESIGN NOTE:
- (near R?#40) CAD NOTE:
- PLACE CLOSE TO EACH OTHER
- CPU RTC
- MAX 2 LOADS SUPPORTED
- PCH RTC OUT
- USE 3 PAD
- (in symbol C_RPL_HX_EXT, part F) 6 OF 19

### Library data of the parts
R?#34 R?#37 R?#38 R?#41 R?#42 = Res: Thick Film Resistor -  0ohm, 1%, 0402
  R?#41 R?#42: DNP: DNP
R?#35 R?#36 R?#40 = Res: Thick Film Resistor -  33ohm, 1%, 0402
  R?#36: DNP: DNP
R?#39 = Res: Thick Film Resistor -  1Kohm, 1%, 0402; DNP: DNP
U?#2 = TTL1T45: CDS_LMAN_SYM_OUTLINE: -200,100,200,-100; OriginalSymbolOrigin: (-225,100); PACK_TYPE: ?